# EAGLE design PMS alpha_v0.2 (EAGLE 9.0.1)

## Sheet 1 of 7
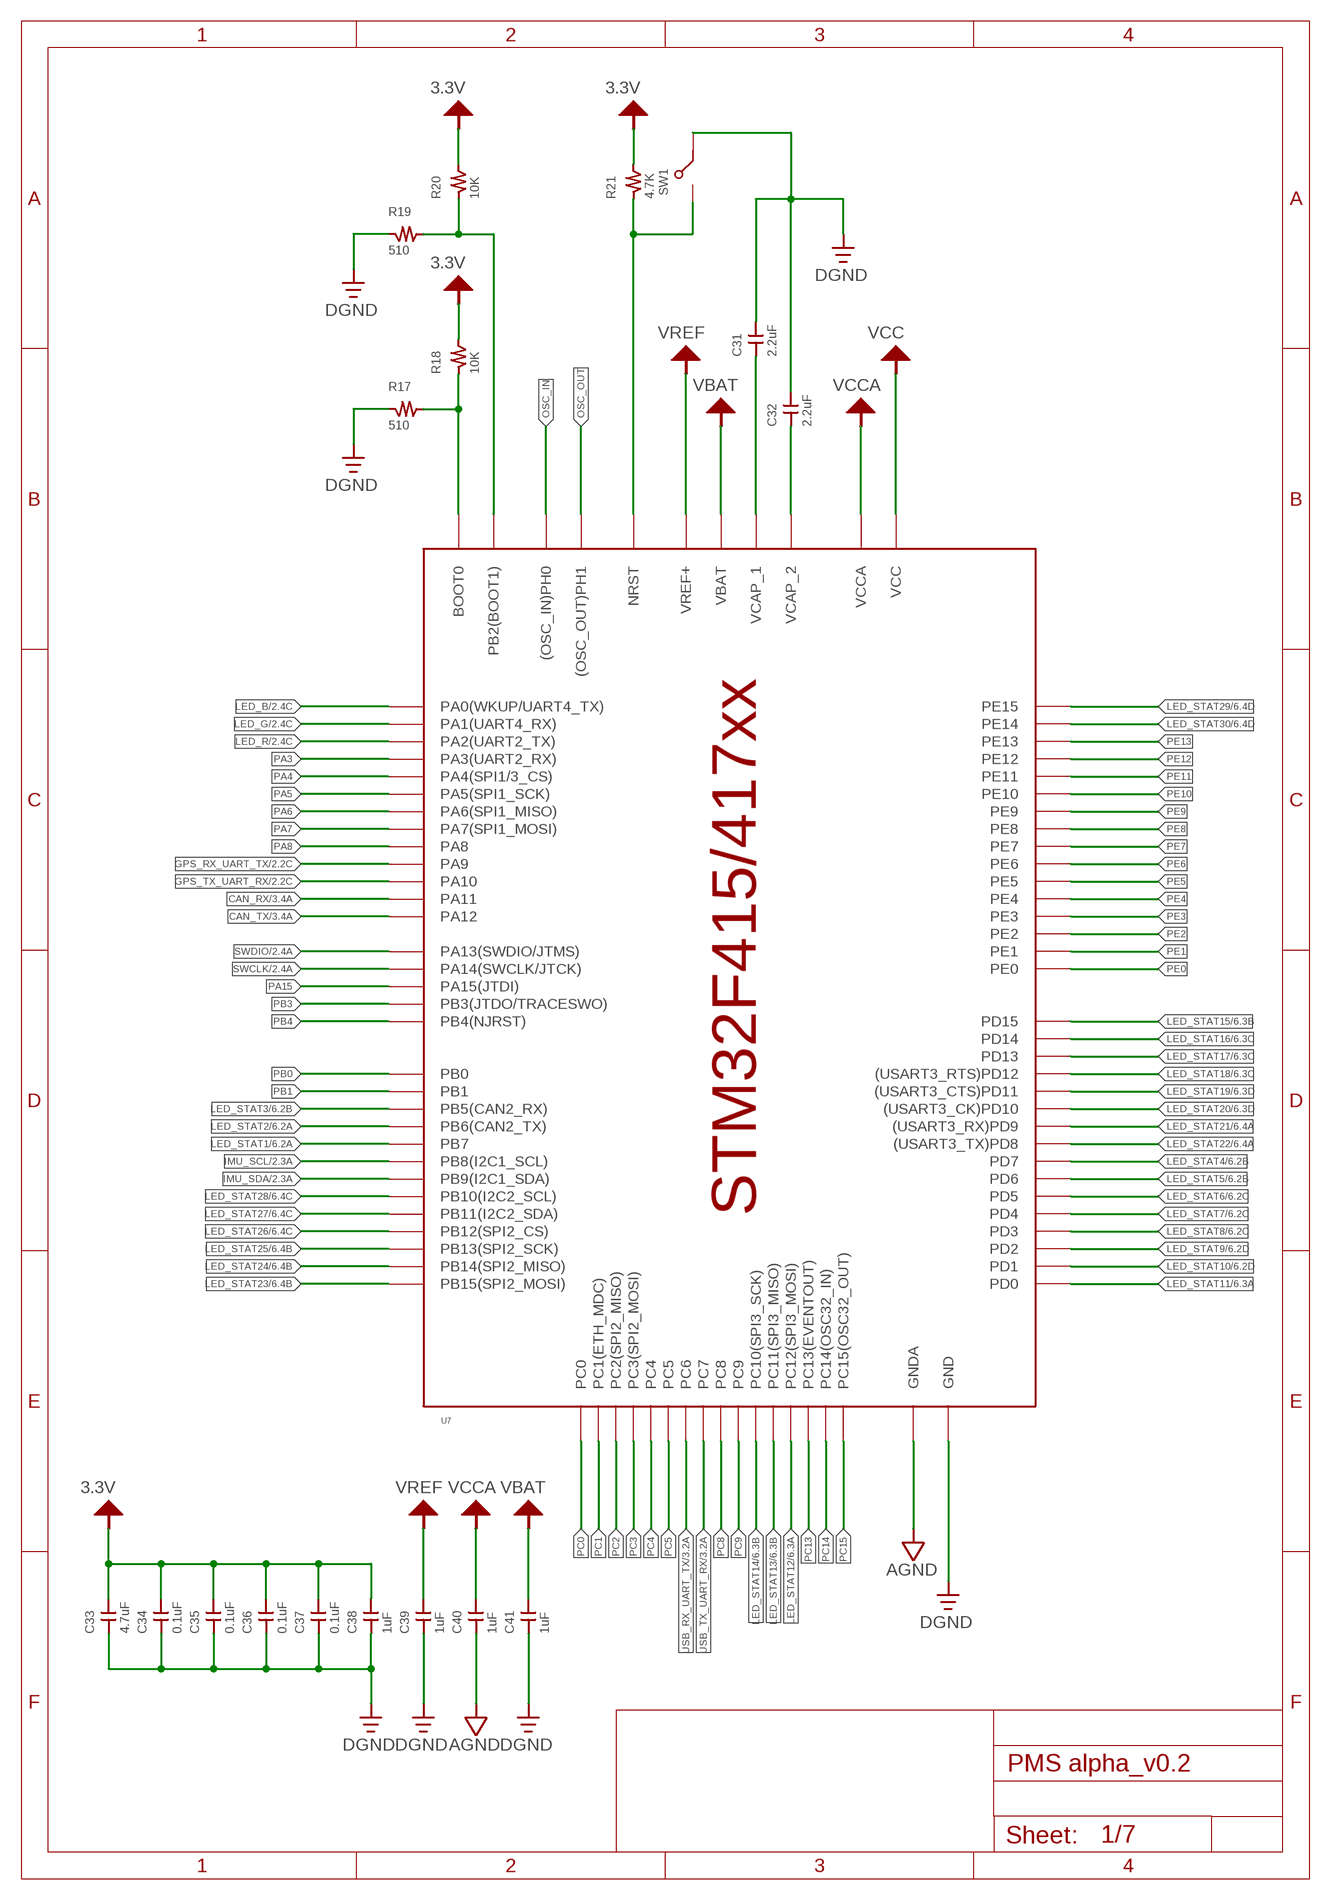
[diagram p0: schematic, sheet 1]

### Parts
C31  2.2uF  CAPACITOR_CHIP2012  [2012]
C32  2.2uF  CAPACITOR_CHIP2012  [2012]
C33  4.7uF  CAPACITOR_CHIP2012  [2012]
C34  0.1uF  CAPACITOR_CHIP2012  [2012]
C35  0.1uF  CAPACITOR_CHIP2012  [2012]
C36  0.1uF  CAPACITOR_CHIP2012  [2012]
C37  0.1uF  CAPACITOR_CHIP2012  [2012]
C38  1uF  CAPACITOR_CHIP2012  [2012]
C39  1uF  CAPACITOR_CHIP2012  [2012]
C40  1uF  CAPACITOR_CHIP2012  [2012]
C41  1uF  CAPACITOR_CHIP2012  [2012]
R17  510  RESISTOR_CHIP_2012  [2012]
R18  10K  RESISTOR_CHIP_2012  [2012]
R19  510  RESISTOR_CHIP_2012  [2012]
R20  10K  RESISTOR_CHIP_2012  [2012]
R21  4.7K  RESISTOR_CHIP_2012  [2012]
SW1  SPST(6.5PITCH)  [6.5PITCH]
U7  STM32F415/417  [LQFP100]

### Nets
!NRST: R21.P$1 SW1.P$1 U7.P$14(NRST)
BOOT4: R19.P$2 R20.P$1 U7.P$37(PB2(BOOT1))
BOOT5: R17.P$2 R18.P$1 U7.P$94(BOOT0)
CAN_RX: U7.P$70(PA11) ; also sheet 3
CAN_TX: U7.P$71(PA12) ; also sheet 3
DGND: C31.P$2 C32.P$2 C33.P$1 C34.P$1 C35.P$1 C36.P$1 C37.P$1 C38.P$1 C39.P$1 C40.P$1 C41.P$1 R17.P$1 R19.P$1 SW1.P$2 U7.P$10(GND) U7.P$20(GNDA) U7.P$27(GND) U7.P$74(GND) U7.P$99(GND) ; supply symbol labelled AGND ; also sheet 2,3,4,5
GPS_RX_UART_TX: U7.P$68(PA9) ; also sheet 2
GPS_TX_UART_RX: U7.P$69(PA10) ; also sheet 2
IMU_SCL: U7.P$95(PB8(I2C1_SCL)) ; also sheet 2
IMU_SDA: U7.P$96(PB9(I2C1_SDA)) ; also sheet 2
LED_B: U7.P$23(PA0(WKUP/UART4_TX)) ; also sheet 2
LED_G: U7.P$24(PA1(UART4_RX)) ; also sheet 2
LED_R: U7.P$25(PA2(UART2_TX)) ; also sheet 2
LED_STAT1: U7.P$93(PB7) ; also sheet 6
LED_STAT2: U7.P$92(PB6(CAN2_TX)) ; also sheet 6
LED_STAT3: U7.P$91(PB5(CAN2_RX)) ; also sheet 6
LED_STAT4: U7.P$88(PD7) ; also sheet 6
LED_STAT5: U7.P$87(PD6) ; also sheet 6
LED_STAT6: U7.P$86(PD5) ; also sheet 6
LED_STAT7: U7.P$85(PD4) ; also sheet 6
LED_STAT8: U7.P$84(PD3) ; also sheet 6
LED_STAT9: U7.P$83(PD2) ; also sheet 6
LED_STAT10: U7.P$82(PD1) ; also sheet 6
LED_STAT11: U7.P$81(PD0) ; also sheet 6
LED_STAT12: U7.P$80(PC12(SPI3_MOSI)) ; also sheet 6
LED_STAT13: U7.P$79(PC11(SPI3_MISO)) ; also sheet 6
LED_STAT14: U7.P$78(PC10(SPI3_SCK)) ; also sheet 6
LED_STAT15: U7.P$62(PD15) ; also sheet 6
LED_STAT16: U7.P$61(PD14) ; also sheet 6
LED_STAT17: U7.P$60(PD13) ; also sheet 6
LED_STAT18: U7.P$59((USART3_RTS)PD12) ; also sheet 6
LED_STAT19: U7.P$58((USART3_CTS)PD11) ; also sheet 6
LED_STAT20: U7.P$57((USART3_CK)PD10) ; also sheet 6
LED_STAT21: U7.P$56((USART3_RX)PD9) ; also sheet 6
LED_STAT22: U7.P$55((USART3_TX)PD8) ; also sheet 6
LED_STAT23: U7.P$54(PB15(SPI2_MOSI)) ; also sheet 6
LED_STAT24: U7.P$53(PB14(SPI2_MISO)) ; also sheet 6
LED_STAT25: U7.P$52(PB13(SPI2_SCK)) ; also sheet 6
LED_STAT26: U7.P$51(PB12(SPI2_CS)) ; also sheet 6
LED_STAT27: U7.P$48(PB11(I2C2_SDA)) ; also sheet 6
LED_STAT28: U7.P$47(PB10(I2C2_SCL)) ; also sheet 6
LED_STAT29: U7.P$46(PE15) ; also sheet 6
LED_STAT30: U7.P$45(PE14) ; also sheet 6
OSC_IN: U7.P$12((OSC_IN)PH0)
OSC_OUT: U7.P$13((OSC_OUT)PH1)
PA3: U7.P$26(PA3(UART2_RX))
PA4: U7.P$29(PA4(SPI1/3_CS))
PA5: U7.P$30(PA5(SPI1_SCK))
PA6: U7.P$31(PA6(SPI1_MISO))
PA7: U7.P$32(PA7(SPI1_MOSI))
PA8: U7.P$67(PA8)
PA15: U7.P$77(PA15(JTDI))
PB0: U7.P$35(PB0)
PB1: U7.P$36(PB1)
PB3: U7.P$89(PB3(JTDO/TRACESWO))
PB4: U7.P$90(PB4(NJRST))
PC0: U7.P$15(PC0)
PC1: U7.P$16(PC1(ETH_MDC))
PC2: U7.P$17(PC2(SPI2_MISO))
PC3: U7.P$18(PC3(SPI2_MOSI))
PC4: U7.P$33(PC4)
PC5: U7.P$34(PC5)
PC8: U7.P$65(PC8)
PC9: U7.P$66(PC9)
PC13: U7.P$7(PC13(EVENTOUT))
PC14: U7.P$8(PC14(OSC32_IN))
PC15: U7.P$9(PC15(OSC32_OUT))
PE0: U7.P$97(PE0)
PE1: U7.P$98(PE1)
PE2: U7.P$1(PE2)
PE3: U7.P$2(PE3)
PE4: U7.P$3(PE4)
PE5: U7.P$4(PE5)
PE6: U7.P$5(PE6)
PE7: U7.P$38(PE7)
PE8: U7.P$39(PE8)
PE9: U7.P$40(PE9)
PE10: U7.P$41(PE10)
PE11: U7.P$42(PE11)
PE12: U7.P$43(PE12)
PE13: U7.P$44(PE13)
SWCLK: U7.P$76(PA14(SWCLK/JTCK)) ; also sheet 2
SWDIO: U7.P$72(PA13(SWDIO/JTMS)) ; also sheet 2
USB_RX_UART_TX: U7.P$63(PC6) ; also sheet 3
USB_TX_UART_RX: U7.P$64(PC7) ; also sheet 3
VCAP5: C32.P$1 U7.P$73(VCAP_2)
VCAP6: C31.P$1 U7.P$49(VCAP_1)
VCC_3.3V: C33.P$2 C34.P$2 C35.P$2 C36.P$2 C37.P$2 C38.P$2 C39.P$2 C40.P$2 C41.P$2 R18.P$2 R20.P$2 R21.P$2 U7.P$6(VBAT) U7.P$11(VCC) U7.P$19(VCC) U7.P$21(VREF+) U7.P$22(VCCA) U7.P$28(VCC) U7.P$50(VCC) U7.P$75(VCC) U7.P$100(VCC) ; supply symbol labelled 3.3V, VCC, VCCA, VBAT, VREF ; also sheet 2,3,4,6

## Sheet 2 of 7
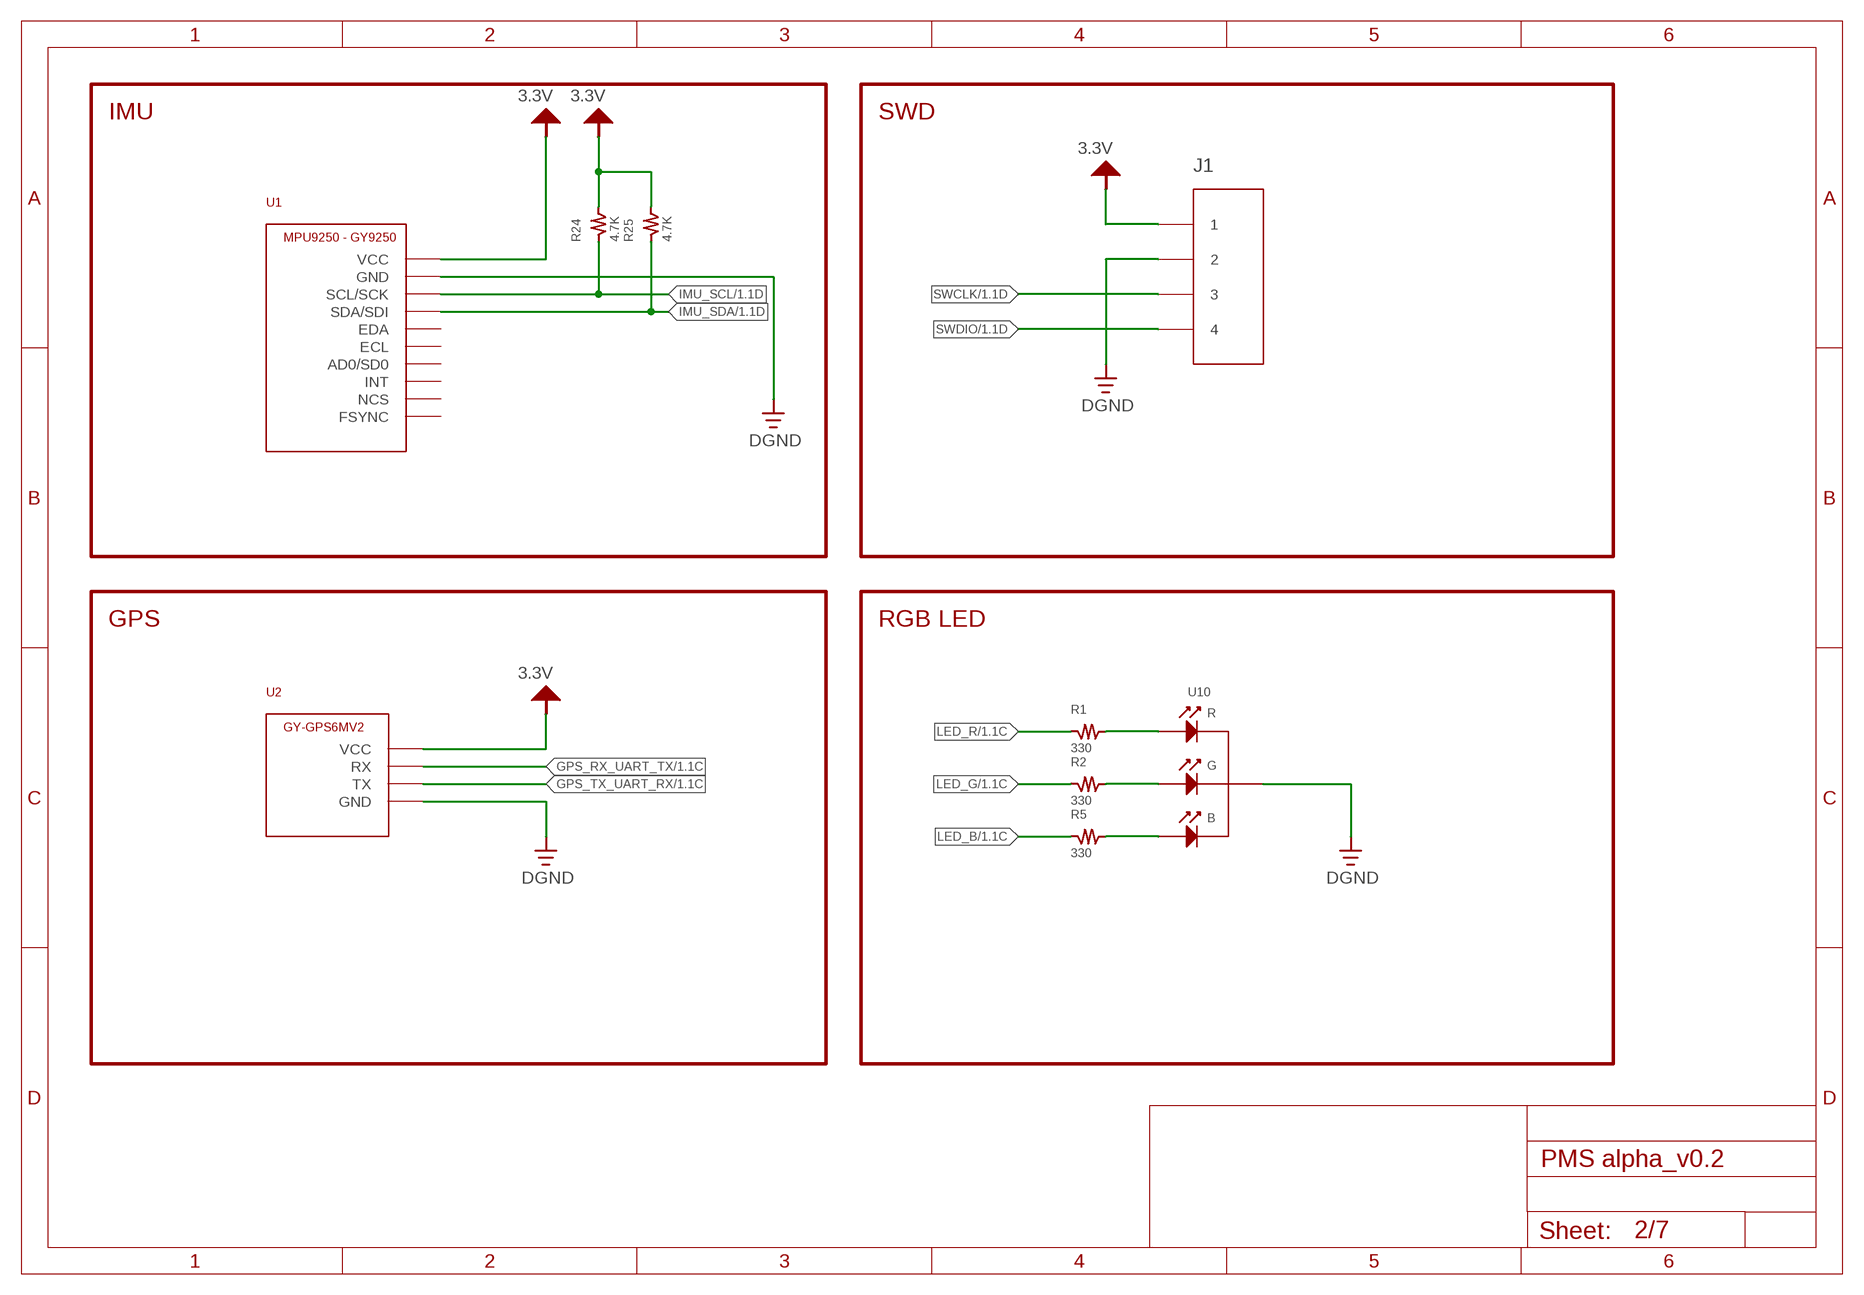
[diagram p1: schematic, sheet 2]

### Parts
J1  4PIN_2.54  [4PIN]
R1  330  RESISTOR_CHIP_2012  [2012]
R2  330  RESISTOR_CHIP_2012  [2012]
R5  330  RESISTOR_CHIP_2012  [2012]
R24  4.7K  RESISTOR_CHIP_2012  [2012]
R25  4.7K  RESISTOR_CHIP_2012  [2012]
U1  MPU-9250  [GY-9250]
U2  GPS6MV2  [PAD_2.5MM]
U10  RGB_COM_K  [RGB_4PIN_2.5MM]

### Nets
DGND: J1.P$2 U1.P$2(GND) U2.P$4(GND) U10.P$4(K) ; also sheet 1,3,4,5
GPS_RX_UART_TX: U2.P$2(RX) ; also sheet 1
GPS_TX_UART_RX: U2.P$3(TX) ; also sheet 1
IMU_SCL: R24.P$1 U1.P$3(SCL/SCK) ; also sheet 1
IMU_SDA: R25.P$1 U1.P$4(SDA/SDI) ; also sheet 1
LED_B: R5.P$1 ; also sheet 1
LED_G: R2.P$1 ; also sheet 1
LED_R: R1.P$1 ; also sheet 1
N$2: R1.P$2 U10.P$1(A)
N$3: R2.P$2 U10.P$2(A)
N$8: R5.P$2 U10.P$3(A)
SWCLK: J1.P$3 ; also sheet 1
SWDIO: J1.P$4 ; also sheet 1
VCC_3.3V: J1.P$1 R24.P$2 R25.P$2 U1.P$1(VCC) U2.P$1(VCC) ; supply symbol labelled 3.3V ; also sheet 1,3,4,6
Unconnected: U1.P$5(EDA) U1.P$6(ECL) U1.P$7(AD0/SD0) U1.P$8(INT) U1.P$9(NCS) U1.P$10(FSYNC)

### Notes on the sheet
- IMU | SWD
- GPS | RGB LED

## Sheet 3 of 7
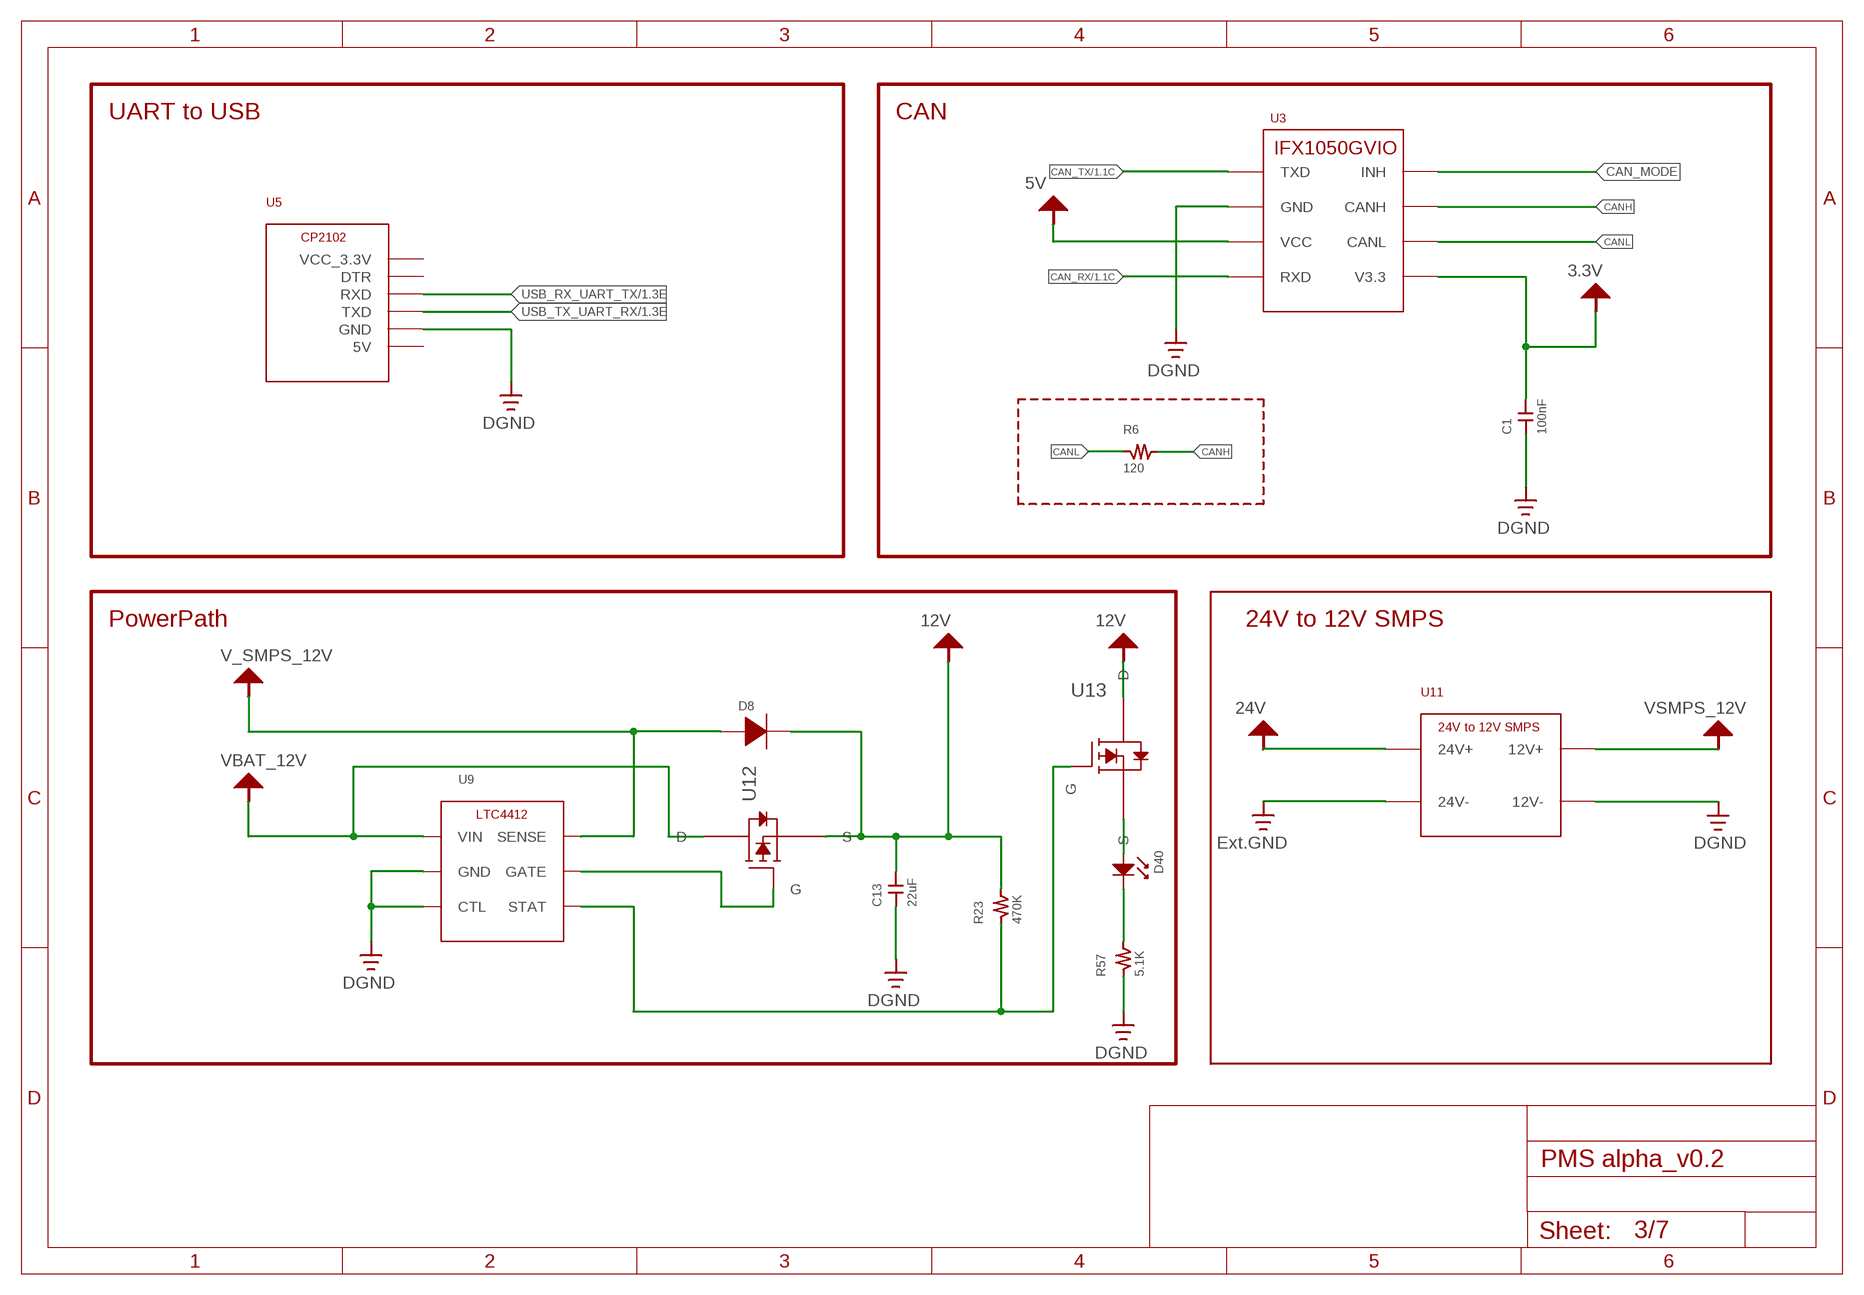
[diagram p2: schematic, sheet 3]

### Parts
C1  100nF  CAPACITOR_CHIP2012  [2012]
C13  22uF  CAPACITOR_CHIP2012  [2012]
D8  SBR10E45P5  [POWERDI5]
D40  LED_CHIP_2012  [2012]
R6  120  RESISTOR_CHIP_2012  [2012]
R23  470K  RESISTOR_CHIP_2012  [2012]
R57  5.1K  RESISTOR_CHIP_2012  [2012]
U3  IFX1050GVIO  [PG-DSO-8]
U5  CP2102-USB  [CP2102-6PIN]
U9  LTC4412ES6  [TSOT-23(3X3)]
U11  24V_TO_12V  [24V_12V_10A]
U12  SI4435FDY  [SO-8]
U13  STR2P3LLH6  [SOT-23-3]

### Nets
12V: C13.P$2 D8.K R23.P$2 U12.1(S) U12.2(S) U12.3(S) U13.3(D) ; also sheet 4
24V: U11.24V+ U11.24V+$1(24V+) ; also sheet 5
CAN_MODE: U3.P8(INH)
CAN_RX: U3.P4(RXD) ; also sheet 1
CAN_TX: U3.P1(TXD) ; also sheet 1
CANH: R6.P$2 U3.P7(CANH)
CANL: R6.P$1 U3.P6(CANL)
DGND: C1.P$1 C13.P$1 R57.P$1 U3.P2(GND) U5.P$5(GND) U9.P$2(GND) U9.P$3(CTL) U11.12V- ; also sheet 1,2,4,5
EXT.GND: U11.24V- U11.24V-$1(24V-) ; supply symbol labelled Ext.GND
N$27: U9.P$5(GATE) U12.4(G)
N$28: R23.P$1 U9.P$4(STAT) U13.1(G)
N$36: D40.K R57.P$2
N$60: D40.A U13.2(S)
USB_RX_UART_TX: U5.P$3(RXD) ; also sheet 1
USB_TX_UART_RX: U5.P$4(TXD) ; also sheet 1
V_SMPS_12V: D8.A$1(A) D8.A$2(A) U9.P$6(SENSE) U11.12V+ ; supply symbol labelled VSMPS_12V
VBAT_12V: U9.P$1(VIN) U12.5(D) U12.6(D) U12.7(D) U12.8(D) ; also sheet 5
VCC_3.3V: C1.P$2 U3.P5(V3.3) ; supply symbol labelled 3.3V ; also sheet 1,2,4,6
VCC_5V: U3.P3(VCC) ; supply symbol labelled 5V ; also sheet 4
Unconnected: U5.P$1(VCC_3.3V) U5.P$2(DTR) U5.P$6(5V)

### Notes on the sheet
- UART to USB | CAN
- PowerPath | 24V to 12V SMPS

## Sheet 4 of 7
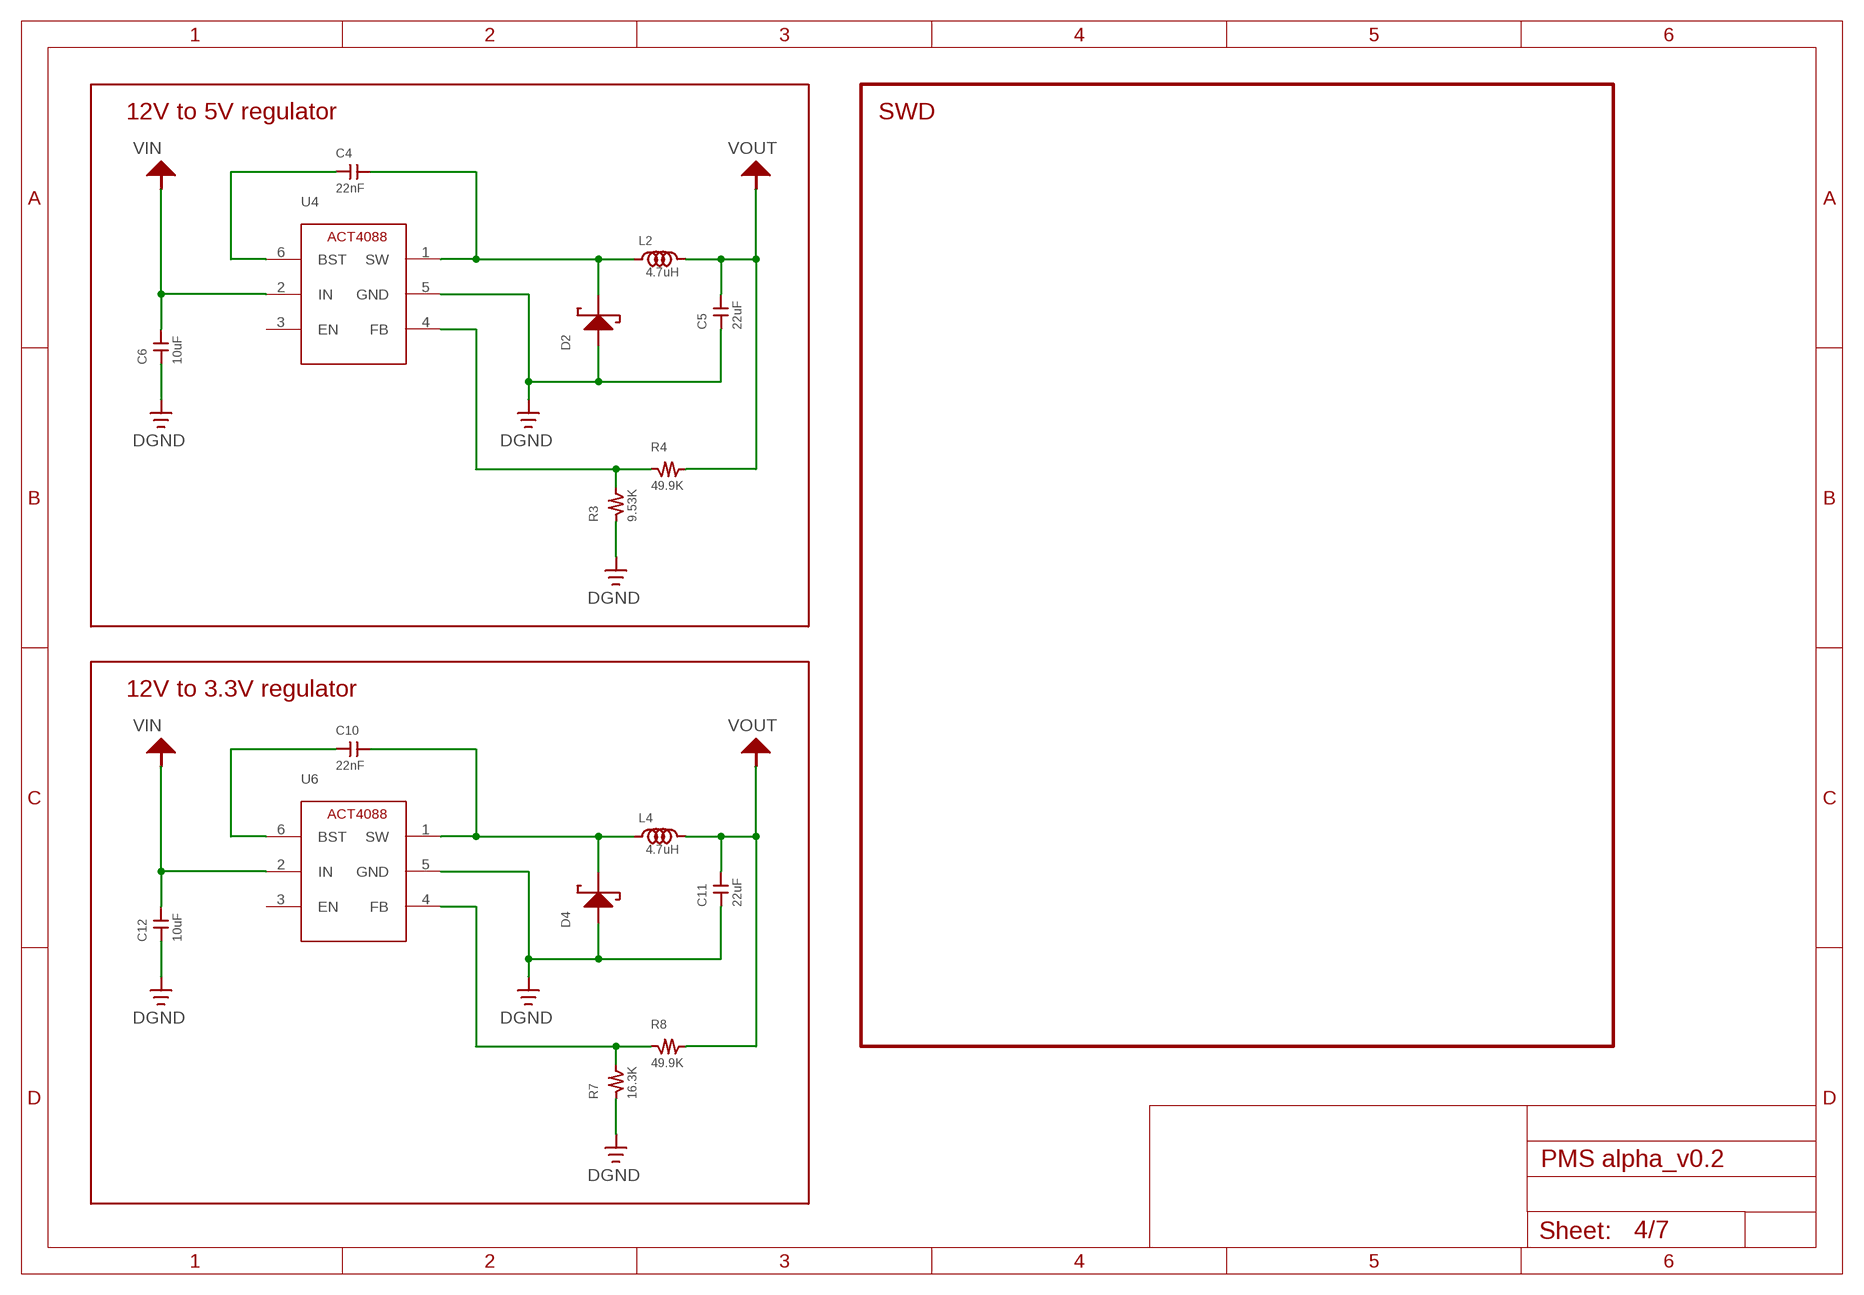
[diagram p3: schematic, sheet 4]

### Parts
C4  22nF  CAPACITOR_CHIP2012  [2012]
C5  22uF  CAPACITOR_CHIP2012  [2012]
C6  10uF  CAPACITOR_CHIP2012  [2012]
C10  22nF  CAPACITOR_CHIP2012  [2012]
C11  22uF  CAPACITOR_CHIP2012  [2012]
C12  10uF  CAPACITOR_CHIP2012  [2012]
D2  NSR20F30  [DSN2(1608)]
D4  NSR20F30  [DSN2(1608)]
L2  4.7uH  INDUCTOR2012  [2012]
L4  4.7uH  INDUCTOR2012  [2012]
R3  9.53K  RESISTOR_CHIP_2012  [2012]
R4  49.9K  RESISTOR_CHIP_2012  [2012]
R7  16.3K  RESISTOR_CHIP_2012  [2012]
R8  49.9K  RESISTOR_CHIP_2012  [2012]
U4  ACT4088US-T  [SOT-23-6]
U6  ACT4088US-T  [SOT-23-6]

### Nets
12V: C6.P$2 C12.P$2 U4.2(IN) U6.2(IN) ; supply symbol labelled VIN ; also sheet 3
DGND: C5.P$1 C6.P$1 C11.P$1 C12.P$1 D2.A D4.A R3.P$1 R7.P$1 U4.5(GND) U6.5(GND) ; also sheet 1,2,3,5
N$4: C4.P$1 U4.6(BST)
N$7: C4.P$2 D2.K L2.P$1 U4.1(SW)
N$9: R3.P$2 R4.P$1 U4.4(FB)
N$13: C10.P$1 U6.6(BST)
N$14: C10.P$2 D4.K L4.P$1 U6.1(SW)
N$15: R7.P$2 R8.P$1 U6.4(FB)
VCC_3.3V: C11.P$2 L4.P$2 R8.P$2 ; supply symbol labelled VOUT ; also sheet 1,2,3,6
VCC_5V: C5.P$2 L2.P$2 R4.P$2 ; supply symbol labelled VOUT ; also sheet 3
Unconnected: U4.3(EN) U6.3(EN)

### Notes on the sheet
- SWD
- 12V to 5V regulator
- 12V to 3.3V regulator

## Sheet 5 of 7
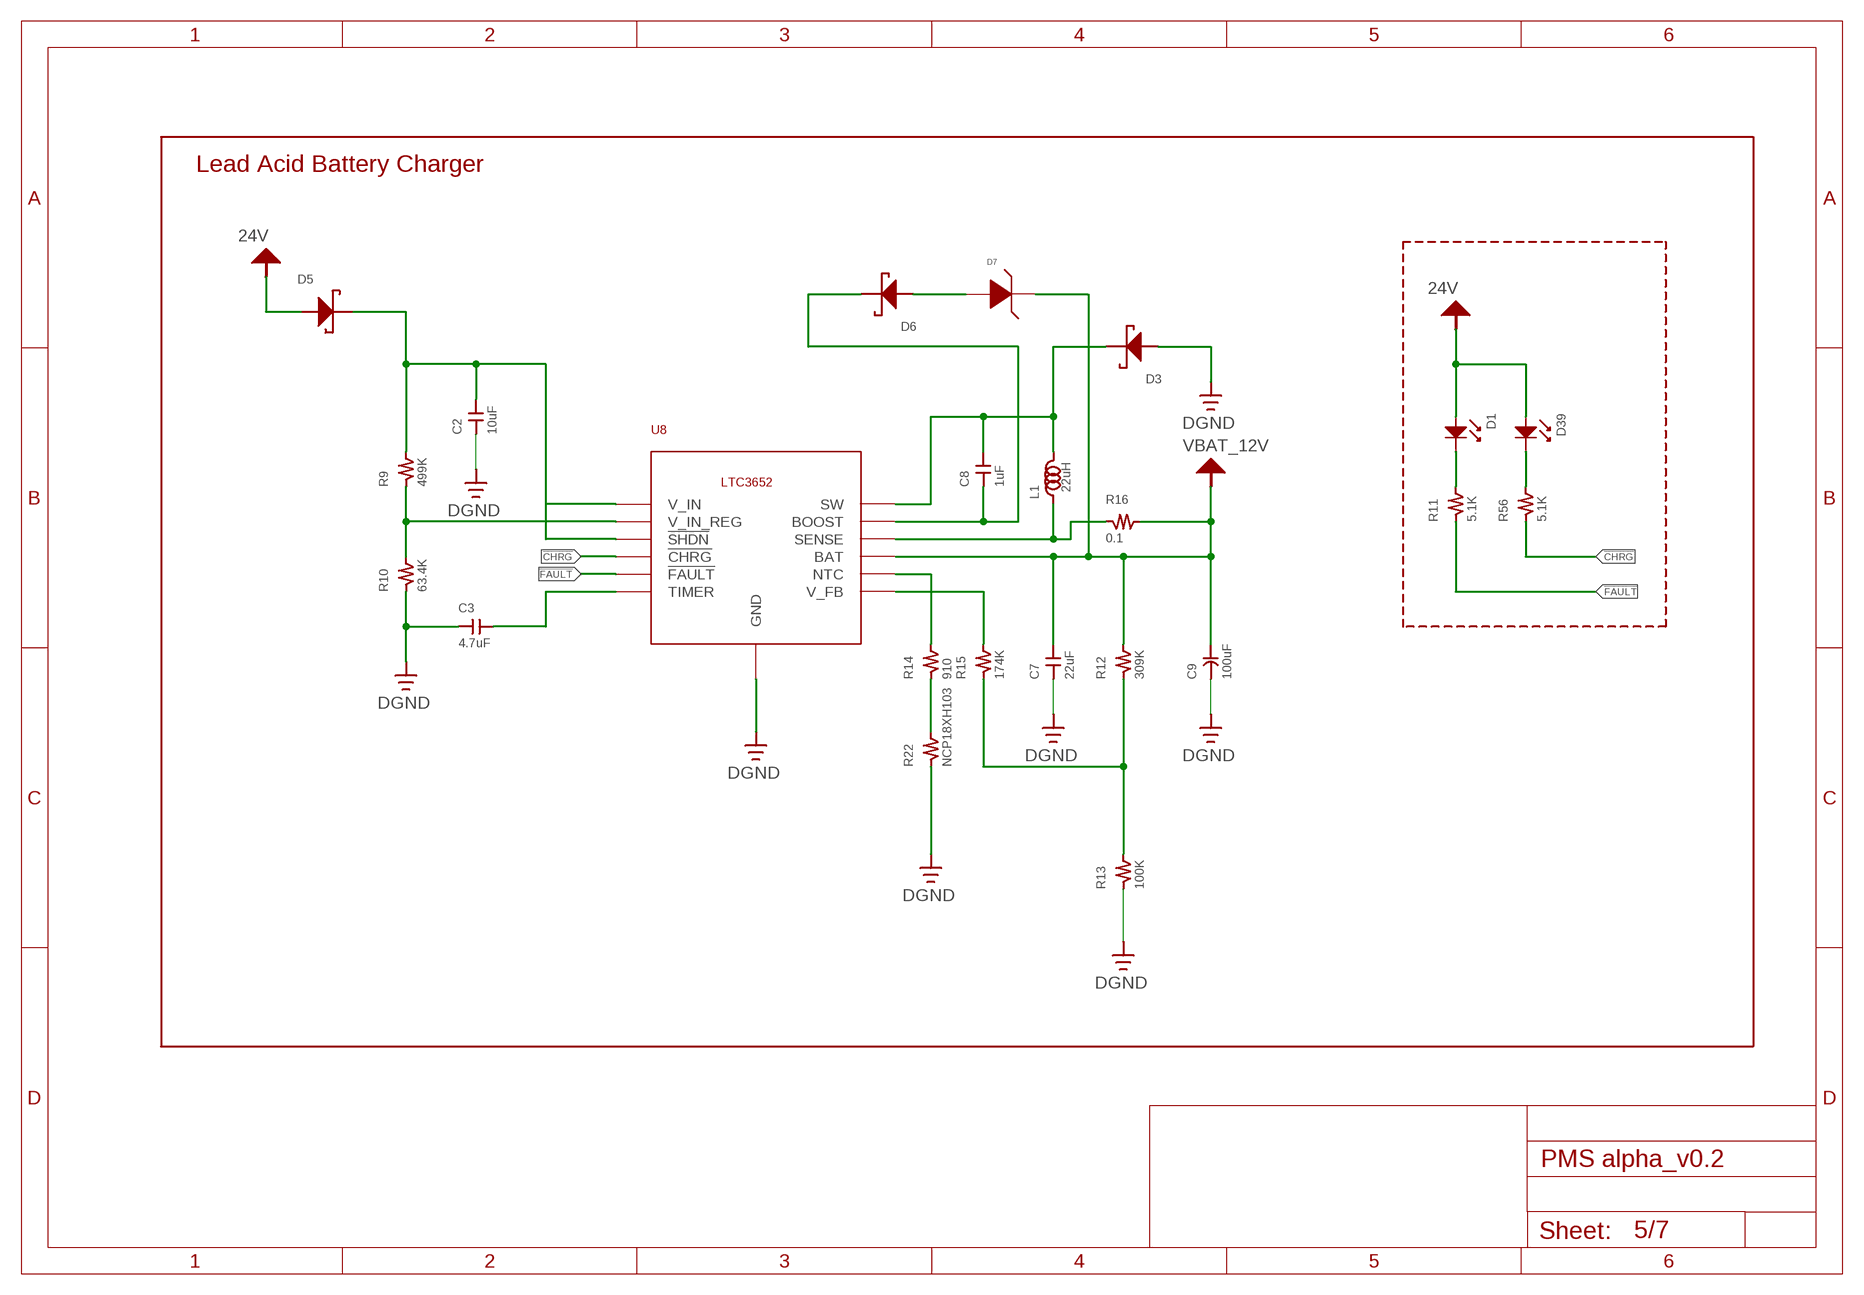
[diagram p4: schematic, sheet 5]

### Parts
C2  10uF  CAPACITOR_CHIP2012  [2012]
C3  4.7uF  CAPACITOR_CHIP2012  [2012]
C7  22uF  CAPACITOR_CHIP2012  [2012]
C8  1uF  CAPACITOR_CHIP2012  [2012]
C9  100uF  CAPACITOR_POLAR_F55_SIZE  [F55_SIZE(SMD)]
D1  LED_CHIP_2012  [2012]
D3  NSR20F30  [DSN2(1608)]
D5  NSR20F30  [DSN2(1608)]
D6  NSR20F30  [DSN2(1608)]
D7  BZX84C6V2L  [SOT-23]
D39  LED_CHIP_2012  [2012]
L1  22uH  INDUCTOR4040  [4040SIZE]
R9  499K  RESISTOR_CHIP_2012  [2012]
R10  63.4K  RESISTOR_CHIP_2012  [2012]
R11  5.1K  RESISTOR_CHIP_2012  [2012]
R12  309K  RESISTOR_CHIP_2012  [2012]
R13  100K  RESISTOR_CHIP_2012  [2012]
R14  910  RESISTOR_CHIP_2012  [2012]
R15  174K  RESISTOR_CHIP_2012  [2012]
R16  0.1  RESISTOR_CHIP_6332  [6432]
R22  NCP18XH103  RESISTOR_CHIP_1608  [1608]
R56  5.1K  RESISTOR_CHIP_2012  [2012]
U8  LTC3652HVIMSE  [MSOP-12]

### Nets
24V: D1.A D5.A D39.A ; also sheet 3
!CHRG!: R56.P$1 U8.P$4(!CHRG!)
!FAULT!: R11.P$1 U8.P$5(!FAULT!)
DGND: C2.P$1 C3.P$1 C7.P$1 C9.GND D3.A R10.P$1 R13.P$1 R22.P$1 U8.P$13(GND) ; also sheet 1,2,3,4
N$10: R9.P$1 R10.P$2 U8.P$2(V_IN_REG)
N$11: C2.P$2 D5.K R9.P$2 U8.P$1(V_IN) U8.P$3(!SHDN!)
N$12: D1.K R11.P$2
N$16: C3.P$2 U8.P$6(TIMER)
N$17: D39.K R56.P$2
N$18: R12.P$1 R13.P$2 R15.P$1
N$19: R14.P$2 U8.P$8(NTC)
N$20: R15.P$2 U8.P$7(V_FB)
N$21: C8.P$2 D3.K L1.P$2 U8.P$12(SW)
N$22: C8.P$1 D6.K U8.P$11(BOOST)
N$23: L1.P$1 R16.P$1 U8.P$10(SENSE)
N$24: R14.P$1 R22.P$2
N$25: D6.A D7.P$1(A)
VBAT_12V: C7.P$2 C9.VCC D7.P$3(K) R12.P$2 R16.P$2 U8.P$9(BAT) ; also sheet 3

### Notes on the sheet
- Lead Acid Battery Charger

## Sheet 6 of 7
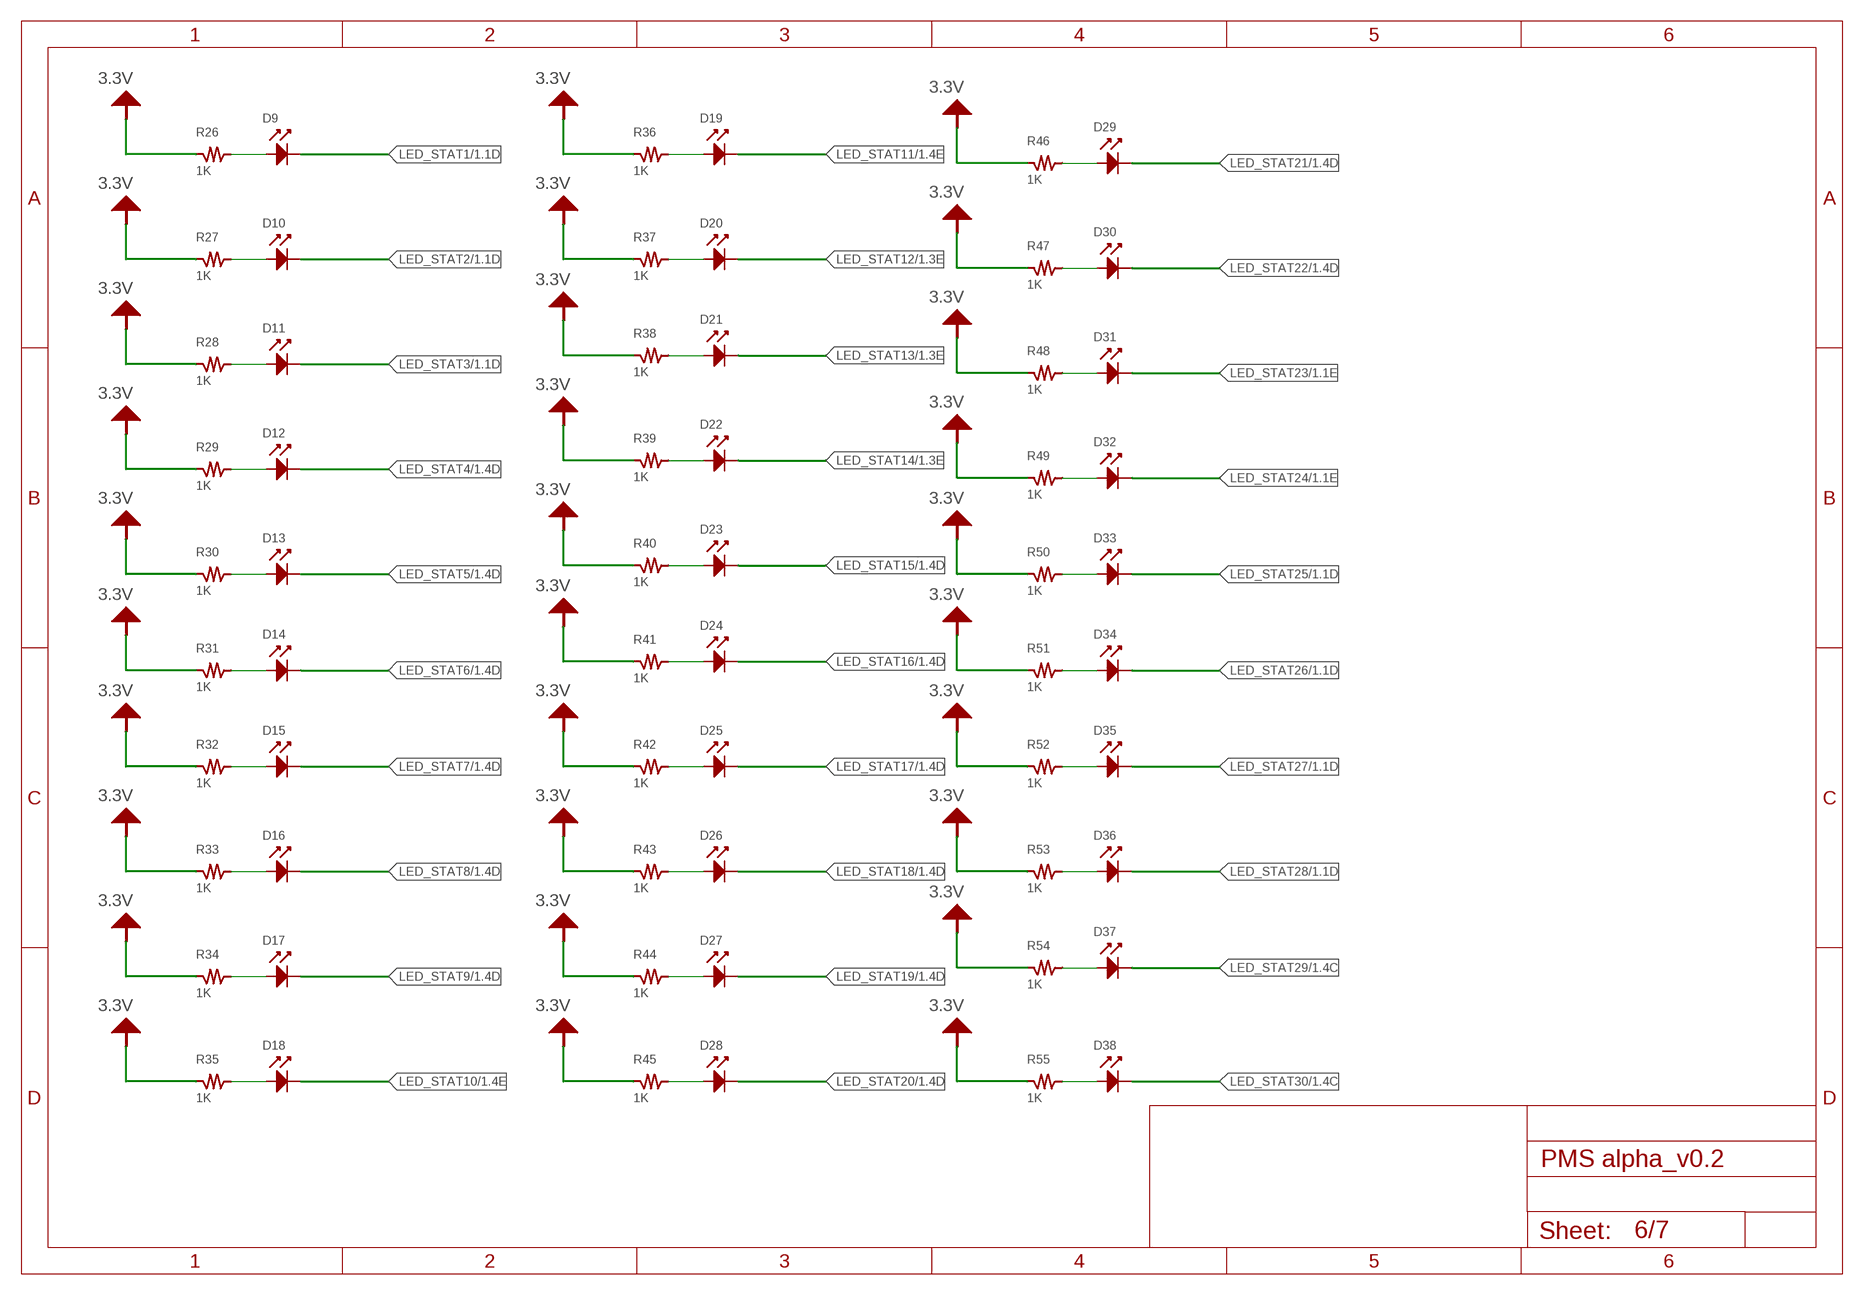
[diagram p5: schematic, sheet 6]

### Parts
D9  LED_5MM_DIP  [DIP_5MM]
D10  LED_5MM_DIP  [DIP_5MM]
D11  LED_5MM_DIP  [DIP_5MM]
D12  LED_5MM_DIP  [DIP_5MM]
D13  LED_5MM_DIP  [DIP_5MM]
D14  LED_5MM_DIP  [DIP_5MM]
D15  LED_5MM_DIP  [DIP_5MM]
D16  LED_5MM_DIP  [DIP_5MM]
D17  LED_5MM_DIP  [DIP_5MM]
D18  LED_5MM_DIP  [DIP_5MM]
D19  LED_5MM_DIP  [DIP_5MM]
D20  LED_5MM_DIP  [DIP_5MM]
D21  LED_5MM_DIP  [DIP_5MM]
D22  LED_5MM_DIP  [DIP_5MM]
D23  LED_5MM_DIP  [DIP_5MM]
D24  LED_5MM_DIP  [DIP_5MM]
D25  LED_5MM_DIP  [DIP_5MM]
D26  LED_5MM_DIP  [DIP_5MM]
D27  LED_5MM_DIP  [DIP_5MM]
D28  LED_5MM_DIP  [DIP_5MM]
D29  LED_5MM_DIP  [DIP_5MM]
D30  LED_5MM_DIP  [DIP_5MM]
D31  LED_5MM_DIP  [DIP_5MM]
D32  LED_5MM_DIP  [DIP_5MM]
D33  LED_5MM_DIP  [DIP_5MM]
D34  LED_5MM_DIP  [DIP_5MM]
D35  LED_5MM_DIP  [DIP_5MM]
D36  LED_5MM_DIP  [DIP_5MM]
D37  LED_5MM_DIP  [DIP_5MM]
D38  LED_5MM_DIP  [DIP_5MM]
R26  1K  RESISTOR_CHIP_2012  [2012]
R27  1K  RESISTOR_CHIP_2012  [2012]
R28  1K  RESISTOR_CHIP_2012  [2012]
R29  1K  RESISTOR_CHIP_2012  [2012]
R30  1K  RESISTOR_CHIP_2012  [2012]
R31  1K  RESISTOR_CHIP_2012  [2012]
R32  1K  RESISTOR_CHIP_2012  [2012]
R33  1K  RESISTOR_CHIP_2012  [2012]
R34  1K  RESISTOR_CHIP_2012  [2012]
R35  1K  RESISTOR_CHIP_2012  [2012]
R36  1K  RESISTOR_CHIP_2012  [2012]
R37  1K  RESISTOR_CHIP_2012  [2012]
R38  1K  RESISTOR_CHIP_2012  [2012]
R39  1K  RESISTOR_CHIP_2012  [2012]
R40  1K  RESISTOR_CHIP_2012  [2012]
R41  1K  RESISTOR_CHIP_2012  [2012]
R42  1K  RESISTOR_CHIP_2012  [2012]
R43  1K  RESISTOR_CHIP_2012  [2012]
R44  1K  RESISTOR_CHIP_2012  [2012]
R45  1K  RESISTOR_CHIP_2012  [2012]
R46  1K  RESISTOR_CHIP_2012  [2012]
R47  1K  RESISTOR_CHIP_2012  [2012]
R48  1K  RESISTOR_CHIP_2012  [2012]
R49  1K  RESISTOR_CHIP_2012  [2012]
R50  1K  RESISTOR_CHIP_2012  [2012]
R51  1K  RESISTOR_CHIP_2012  [2012]
R52  1K  RESISTOR_CHIP_2012  [2012]
R53  1K  RESISTOR_CHIP_2012  [2012]
R54  1K  RESISTOR_CHIP_2012  [2012]
R55  1K  RESISTOR_CHIP_2012  [2012]

### Nets
LED_STAT1: D9.K ; also sheet 1
LED_STAT2: D10.K ; also sheet 1
LED_STAT3: D11.K ; also sheet 1
LED_STAT4: D12.K ; also sheet 1
LED_STAT5: D13.K ; also sheet 1
LED_STAT6: D14.K ; also sheet 1
LED_STAT7: D15.K ; also sheet 1
LED_STAT8: D16.K ; also sheet 1
LED_STAT9: D17.K ; also sheet 1
LED_STAT10: D18.K ; also sheet 1
LED_STAT11: D19.K ; also sheet 1
LED_STAT12: D20.K ; also sheet 1
LED_STAT13: D21.K ; also sheet 1
LED_STAT14: D22.K ; also sheet 1
LED_STAT15: D23.K ; also sheet 1
LED_STAT16: D24.K ; also sheet 1
LED_STAT17: D25.K ; also sheet 1
LED_STAT18: D26.K ; also sheet 1
LED_STAT19: D27.K ; also sheet 1
LED_STAT20: D28.K ; also sheet 1
LED_STAT21: D29.K ; also sheet 1
LED_STAT22: D30.K ; also sheet 1
LED_STAT23: D31.K ; also sheet 1
LED_STAT24: D32.K ; also sheet 1
LED_STAT25: D33.K ; also sheet 1
LED_STAT26: D34.K ; also sheet 1
LED_STAT27: D35.K ; also sheet 1
LED_STAT28: D36.K ; also sheet 1
LED_STAT29: D37.K ; also sheet 1
LED_STAT30: D38.K ; also sheet 1
N$1: D9.A R26.P$2
N$5: D10.A R27.P$2
N$6: D15.A R32.P$2
N$32: D11.A R28.P$2
N$33: D12.A R29.P$2
N$34: D13.A R30.P$2
N$35: D14.A R31.P$2
N$37: D16.A R33.P$2
N$38: D17.A R34.P$2
N$39: D18.A R35.P$2
N$40: D19.A R36.P$2
N$41: D20.A R37.P$2
N$42: D21.A R38.P$2
N$43: D22.A R39.P$2
N$44: D23.A R40.P$2
N$45: D24.A R41.P$2
N$46: D25.A R42.P$2
N$47: D26.A R43.P$2
N$48: D27.A R44.P$2
N$49: D28.A R45.P$2
N$50: D29.A R46.P$2
N$51: D30.A R47.P$2
N$52: D31.A R48.P$2
N$53: D32.A R49.P$2
N$54: D33.A R50.P$2
N$55: D34.A R51.P$2
N$56: D35.A R52.P$2
N$57: D36.A R53.P$2
N$58: D37.A R54.P$2
N$59: D38.A R55.P$2
VCC_3.3V: R26.P$1 R27.P$1 R28.P$1 R29.P$1 R30.P$1 R31.P$1 R32.P$1 R33.P$1 R34.P$1 R35.P$1 R36.P$1 R37.P$1 R38.P$1 R39.P$1 R40.P$1 R41.P$1 R42.P$1 R43.P$1 R44.P$1 R45.P$1 R46.P$1 R47.P$1 R48.P$1 R49.P$1 R50.P$1 R51.P$1 R52.P$1 R53.P$1 R54.P$1 R55.P$1 ; supply symbol labelled 3.3V ; also sheet 1,2,3,4

## Sheet 7 of 7
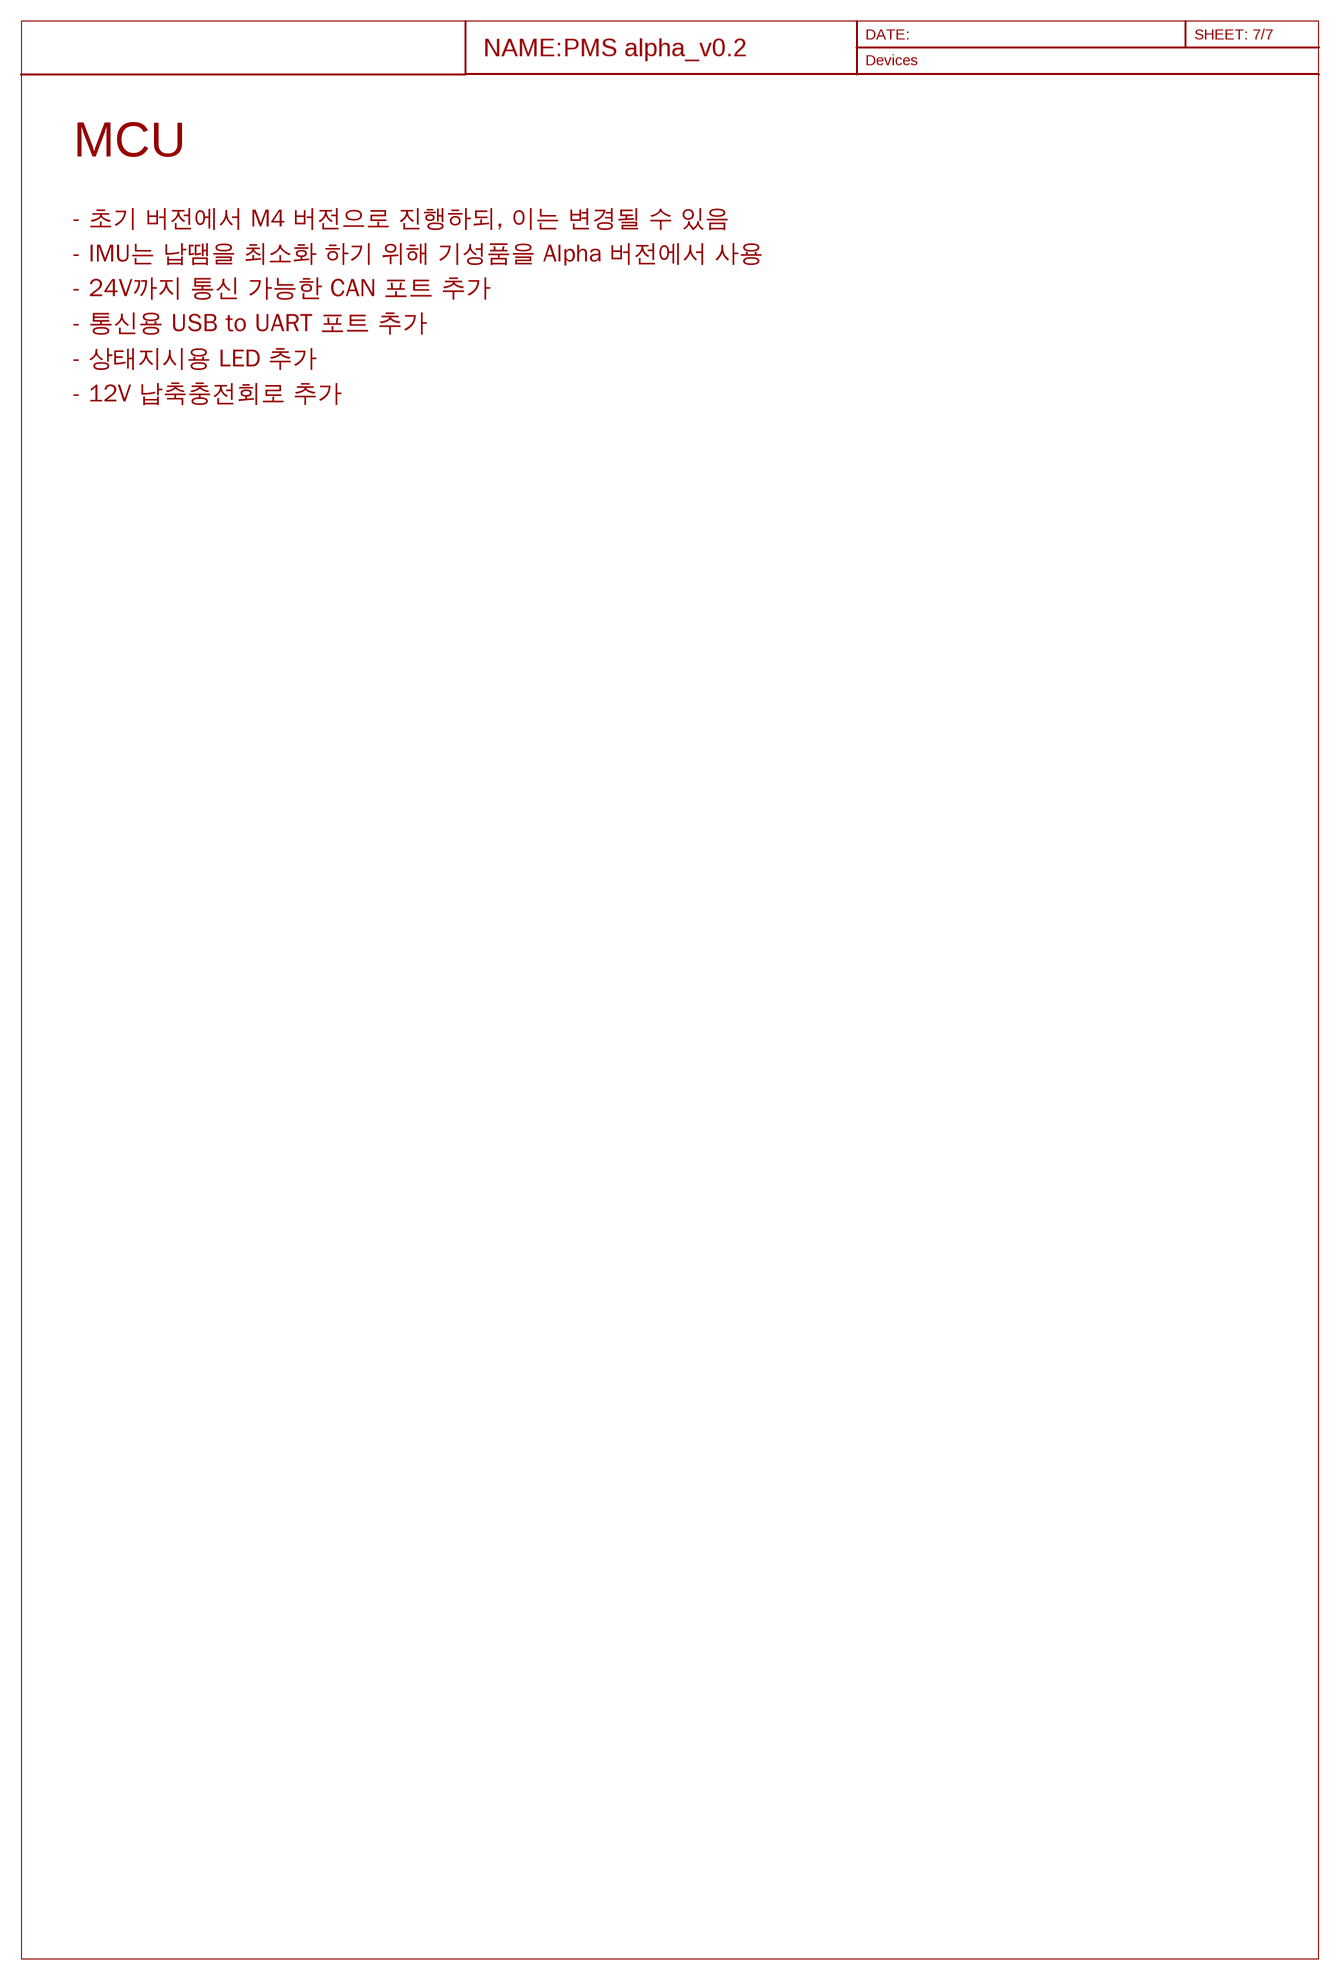
[diagram p6: schematic, sheet 7]

### Notes on the sheet
- MCU
- - 초기 버전에서 M4 버전으로 진행하되, 이는 변경될 수 있음
- - IMU는 납땜을 최소화 하기 위해 기성품을 Alpha 버전에서 사용
- - 24V까지 통신 가능한 CAN 포트 추가
- - 통신용 USB to UART 포트 추가
- - 상태지시용 LED 추가
- - 12V 납축충전회로 추가

## Library data of the parts
C1-C8 C10-C13 C31-C41 = passive:CAPACITOR_CHIP
C9 = passive:CAPACITOR_POLAR_
D1 D9-D40 = LED:LED
D2-D6 = Diode:NSR20F30
D7 = Diode:BZX84C6V2L
D8 = Diode:SBR10E45P5
J1 = connector:4PIN: 2.54mm pitch 4x1 pin Connector (Available as Headers or Pins)
L1 L2 L4 = passive:INDUCTOR
R1-R57 = passive:RESISTOR_CHIP_
SW1 = Switch:SPST: Tactile Switch
U1 = MPU-9250:MPU-9250
U2 = GPS:GPS6MV2
U3 = CAN:IFX1050GVIO: The HS CAN-transceiver IFX1050GVIO is optimized for high speed differential mode data transmission in industrial applications and is compatible to ISO/DIS 11898. It works as an interface between the CAN protocol controller and the physical differential bus in both, 12 V and 24 V systems. The IFX1050GVIO is designed to withstand the conditions of industrial applications and provides excellent EMC performance.
U4 U6 = Regulator:ACT4088: The ACT4088 is a current-mode step-down DC/DC converter that supplies up to 1.5A into 5V from a 12V input. 1.4MHz switching frequency allows the use of tiny external components, and internal loop compensation provides simple, stable power supplies with a minimum of external components. Optimized for use with ceramic input and output capacitors, the ACT4088 provides a very compact 1.5A power supply for space constrained mobile and consumer applications. The ACT4088 operates over a wide input voltage range and utilizes current-mode operation to provide excellent line and load transient response while requiring no external compensation components. Fault protection includes cycle-by-cycle current limiting, frequency fold-back, hiccup mode, and thermal shutdown. Internal soft-start provides a controlled startup with no overshoot, even at light loads. The ACT4088 is available in a tiny SOT23-6 package and requires very few external components.
U5 = USB_to_UART:CP2102-USB
U7 = ST-MCU:STM32F415/417
U8 = BatteryChargeIC:LTC3652
U9 = PowerPath:LTC4412: LTC4412 (Low Loss PowerPath Controller in ThinSOT) The LTC4412 controls an external P-channel MOSFET to create a near ideal diode function for power switchover or load sharing. This permits highly efficient OR’ing of multiple power sources for extended battery life and low selfheating. When conducting, the voltage drop across the MOSFET is typically 20mV. For applications with a wall adapter or other auxiliary power source, the load is automatically disconnected from the battery when the auxiliary source is connected. Two or more LTC4412s may be interconnected to allow load sharing between multiple batteries or charging of multiple batteries from a single charger. The wide supply operating range supports operation from one to six Li-Ion cells in series. The low quiescent current (11μA typical) is independent of the load current. The gate driver includes an internal voltage clamp for MOSFET protection. The STAT pin can be used to enable an auxiliary P-channel MOSFET power switch when an auxiliary supply is detected. This pin may also be used to indicate to a microcontroller that an auxiliary supply is connected. The control (CTL) input enables the user to force the primary MOSFET off and the STAT pin low. The LTC4412 is available in a low profile (1mm) ThinSOT package.
U10 = LED:RGB_COM_K
U11 = SMPS:24V_TO_12V
U12 = MOSFET:SI4435FDY
U13 = MOSFET:STR2P3LLH6: This device is a P-channel Power MOSFET developed using the STripFET™ H6 technology with a new trench gate structure. The resulting Power MOSFET exhibits very low RDS(on) in all packages.

## Board
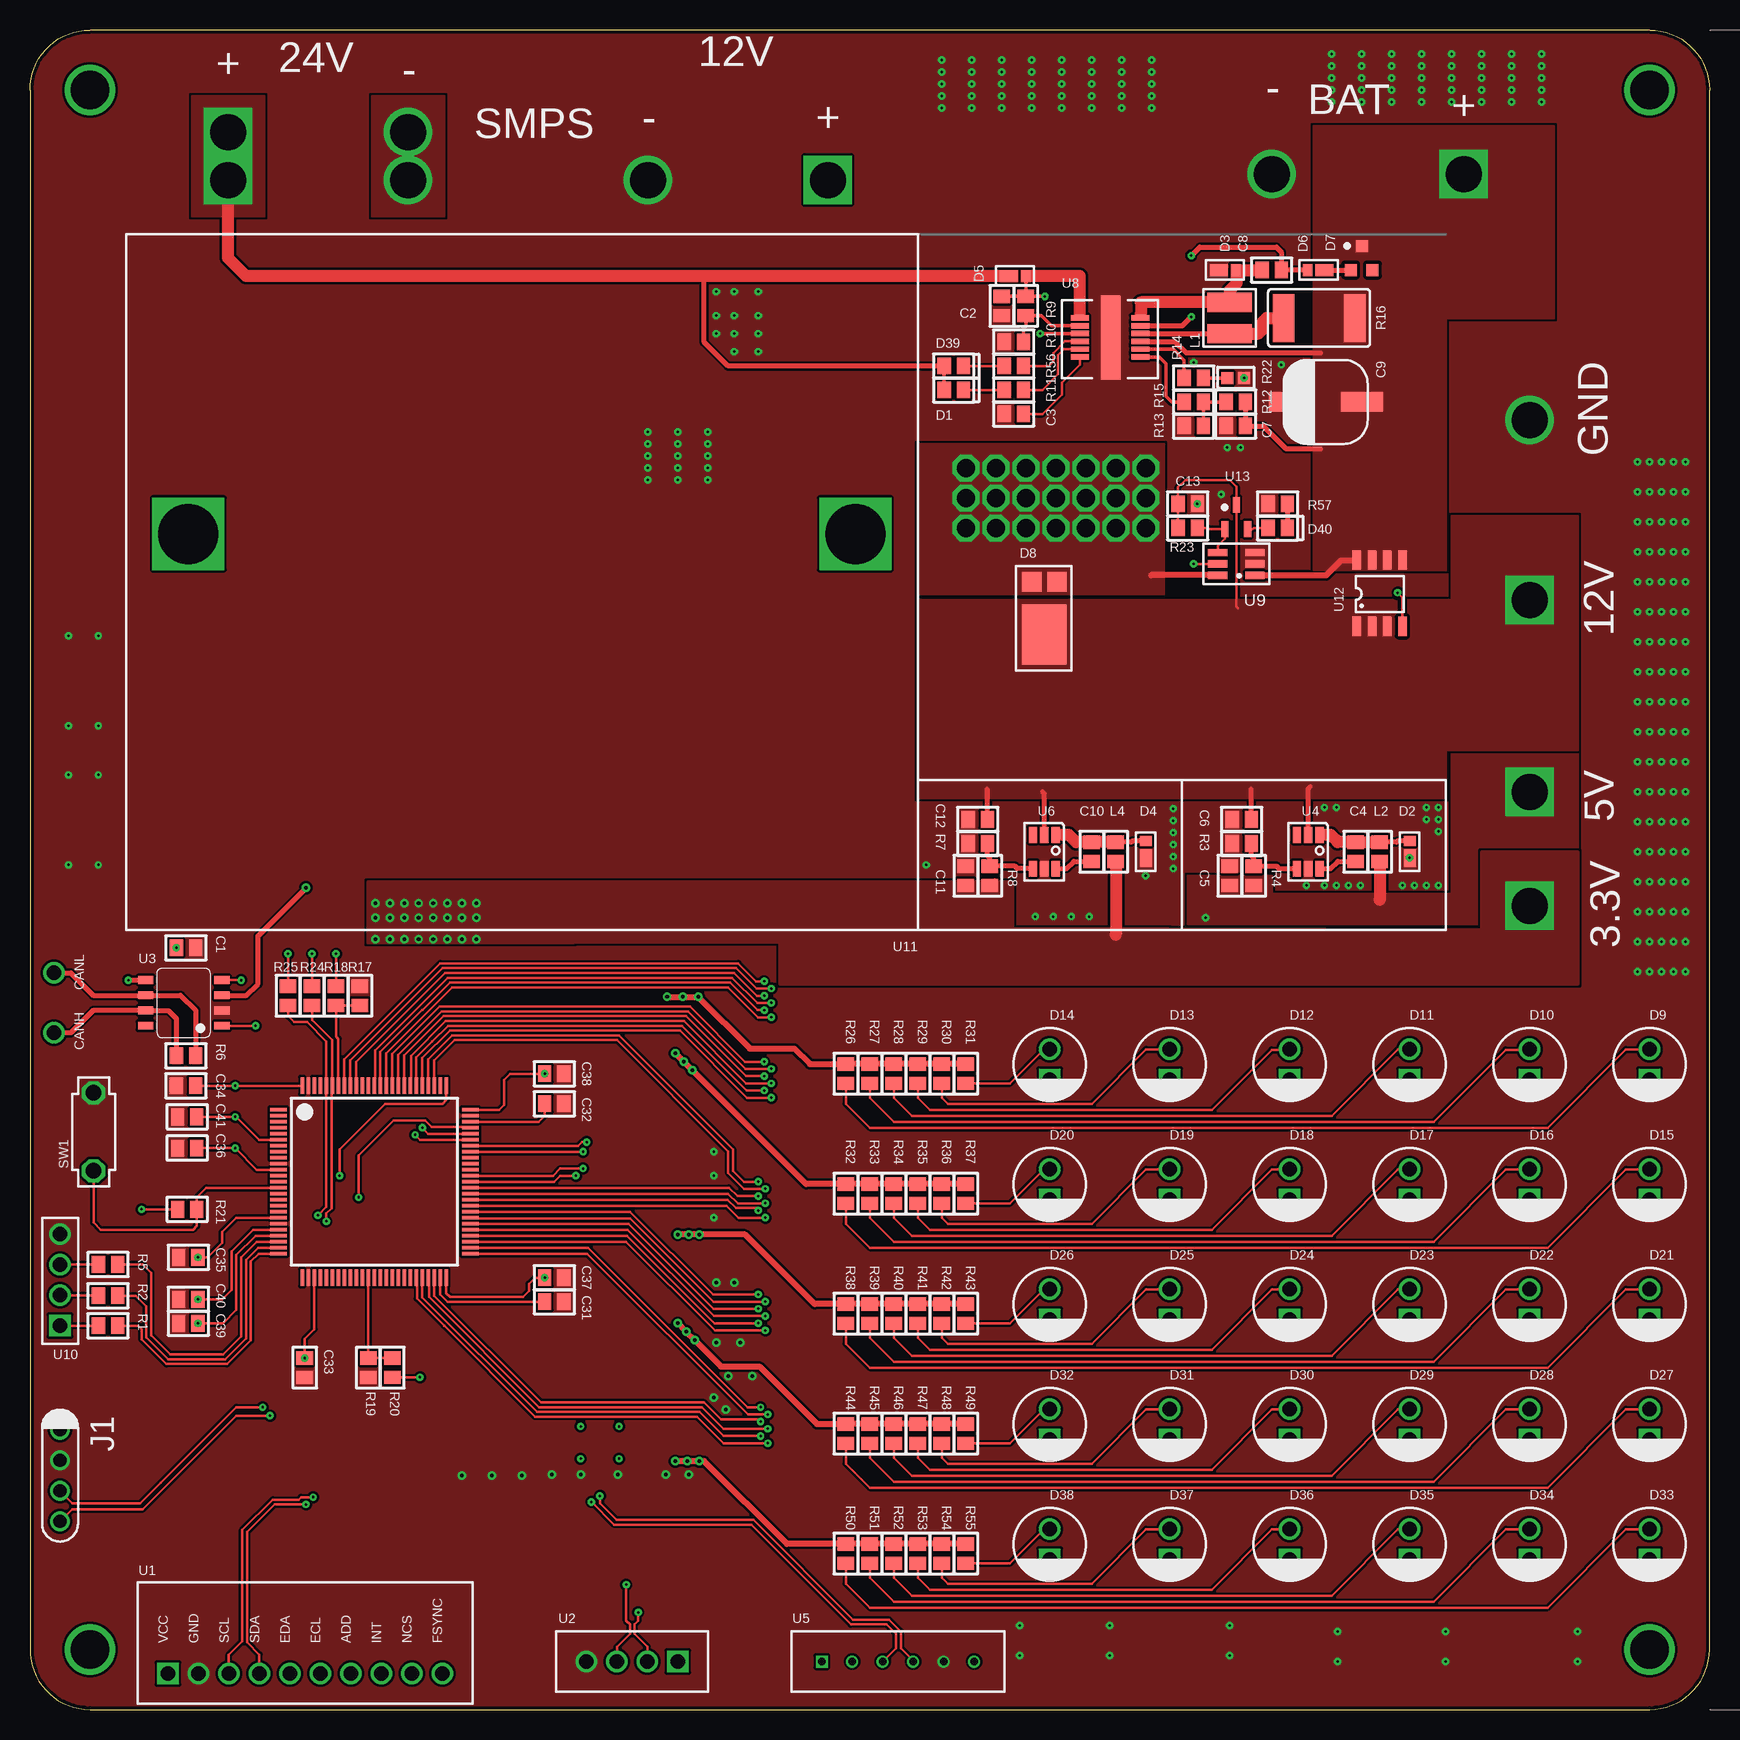
[diagram p7: board, top side]
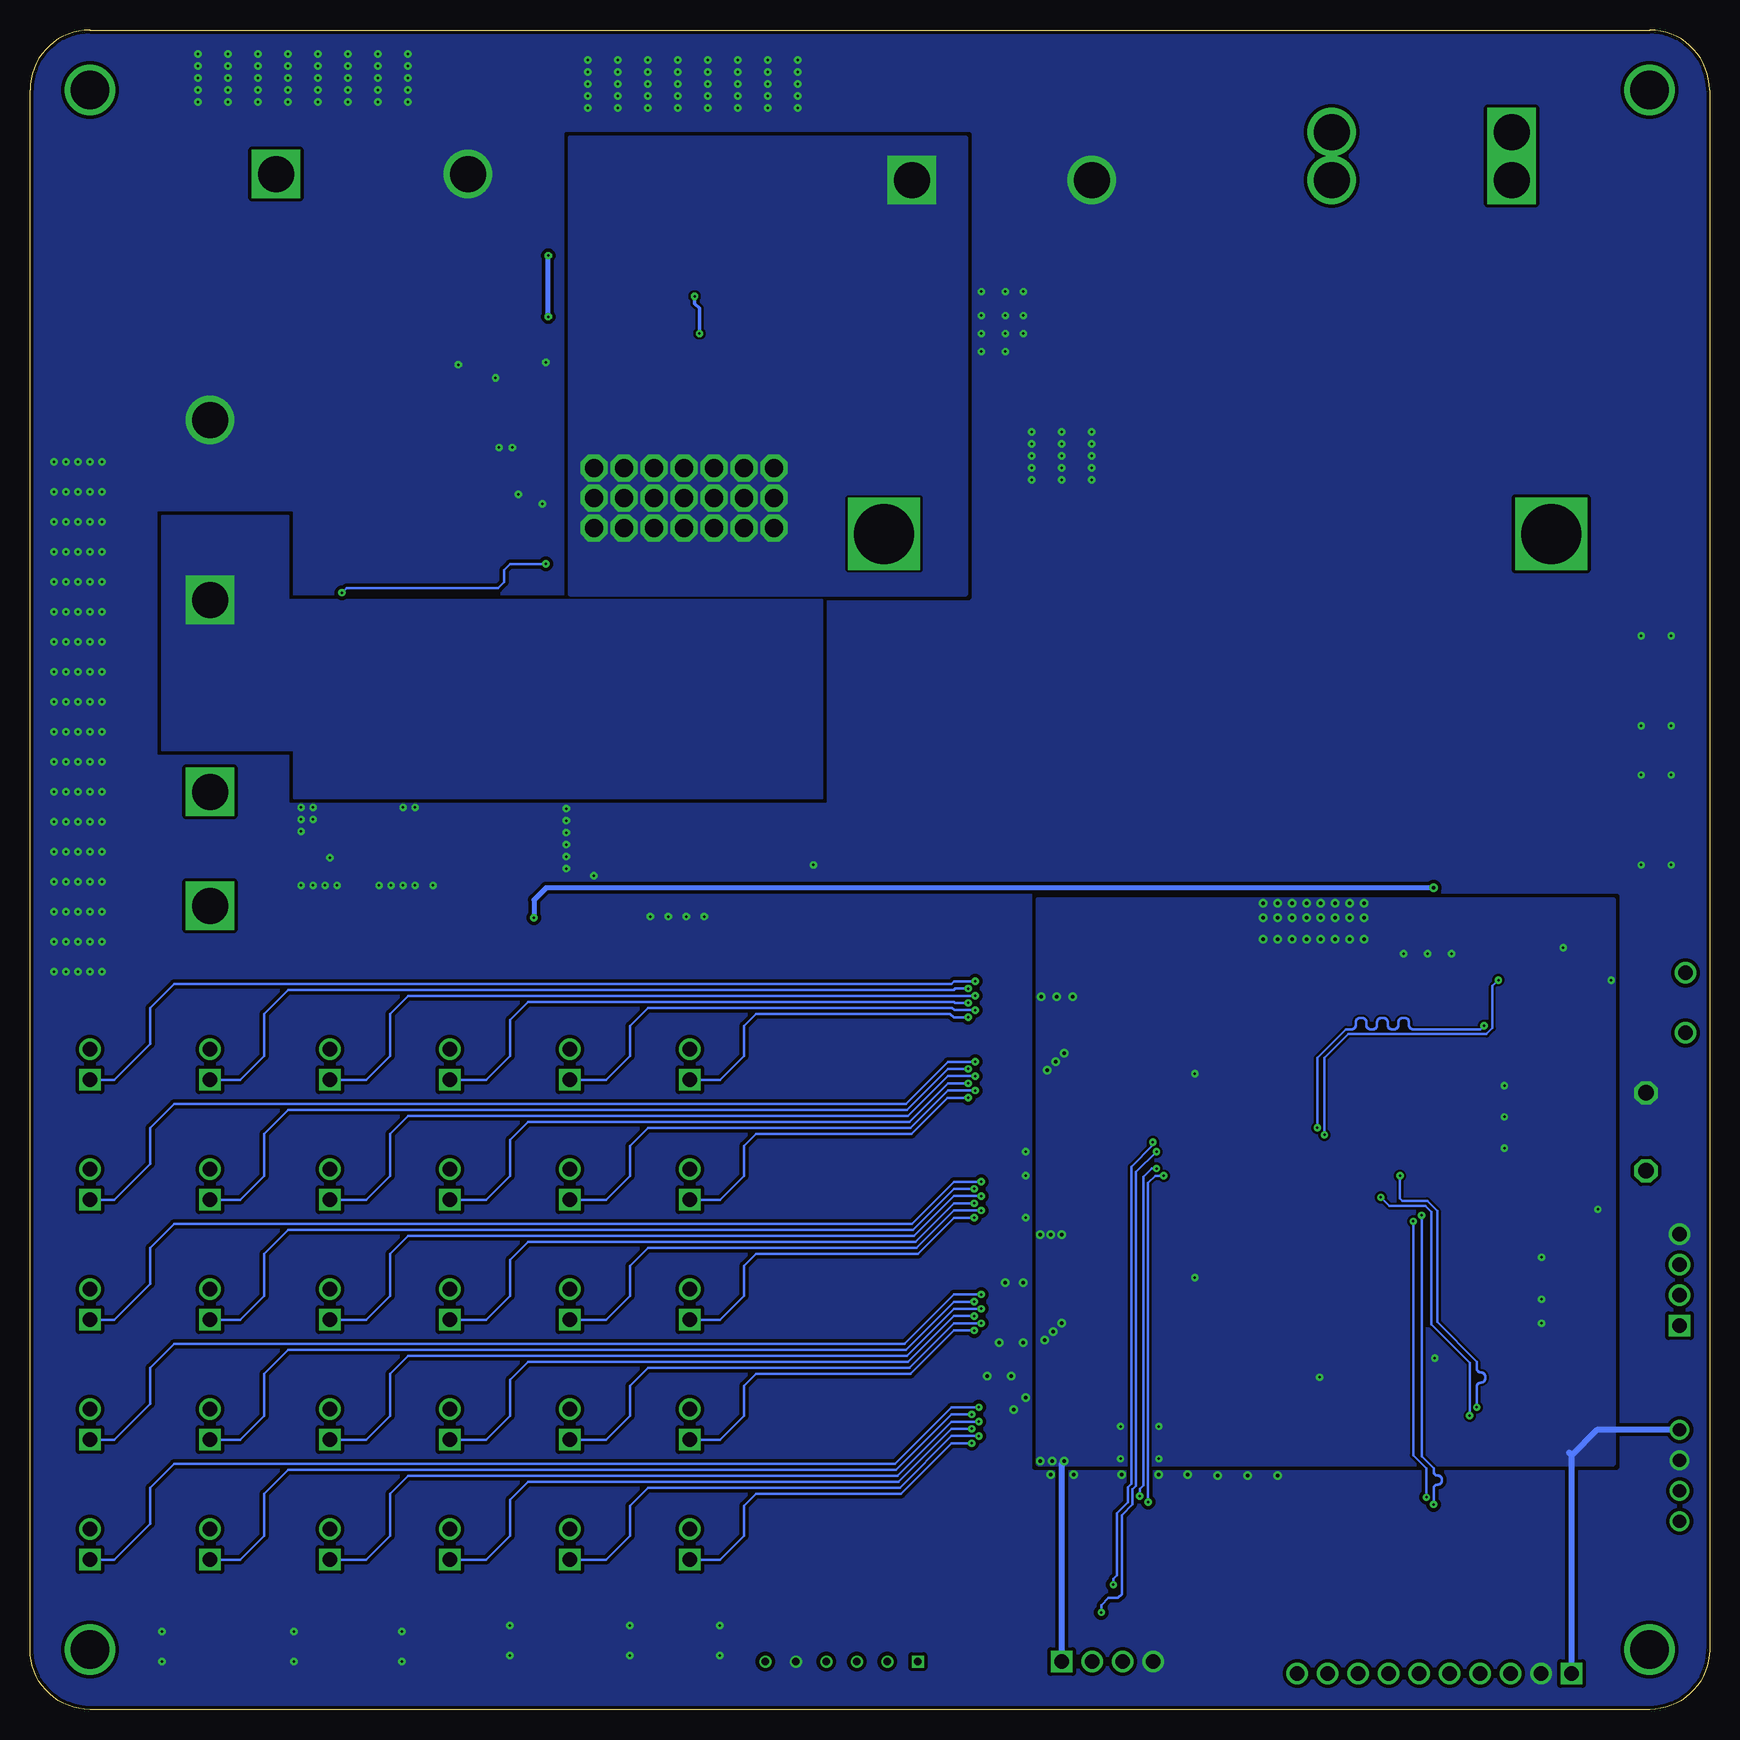
[diagram p8: board, bottom side, seen from below]

Size 140 x 140 mm. Coordinates in mm from the lower left corner, seen from the top.
Outline: 5,0 135,0 arc90 140,5 140,135 arc90 135,140 5,140 arc90 0,135 0,5 arc90 5,0
Copper layers (1*2*15*16): Top 0.035mm / dielectric 0.2mm / Route2 0.035mm / dielectric 1.06mm / Route15 0.035mm / dielectric 0.2mm / Bottom 0.035mm
Design rules "hsdgt3_1oz": minimum track width 0.2mm, minimum drill 0.2mm, track to track 0.2mm, track to pad 0.2mm, pad to pad 0.2mm, via to via 0.2mm, smd to smd 0mil, copper to edge 0.3mm, drill to drill 8mil, minimum pad ring 0.2mm, minimum via ring 0.2mm, stop-mask expansion 0mil, vias tented up to drill 0.3mm, thermal gap 10mil

### Footprints (pad centres in the part's own frame; a part is rotated, then mirrored left to right if it is on the bottom)
2012 = smd 1.4 x 1.1: P$1 0,0.8; P$2 0,-0.8
F55_SIZE(SMD) = smd 3.5 x 1.6: GND -3,0; VCC 3,0
2012' = smd 1.1 x 1.4: A -0.8,0; K 0.8,0
DSN2(1608) = smd 1.5 x 1: A 1.4,0 | smd 0.8 x 1: K 0,0
SOT-23 = smd 1 x 1: P$1 -0.9,-2; P$2 0.9,-2; P$3 0,0
POWERDI5 = smd 1.6 x 1.6: A$1 0,2.1; A$2 0,0 | smd 5 x 3.7: K 4.4,1.05
DIP_5MM = drill 1.2: A 0,2.54 | drill 1.2 square: K 0,0
4PIN = drill 1.1: P$1 -3.81,0; P$2 -1.27,0; P$3 1.27,0; P$4 3.81,0
4040SIZE = smd 1.6 x 3.7: P$1 1.3,0; P$2 -1.3,0
6432 = smd 1.8 x 4: P$1 -3,0; P$2 2.9,0
1608 = smd 1 x 1: P$1 0,0.7; P$2 0,-0.7
6.5PITCH = drill 1.3 octagon: P$1 0,0; P$2 6.5,0
GY-9250 = drill 1.2 square: P$1 0,0 | drill 1.2: P$2 0,-2.54; P$3 0,-5.08; P$4 0,-7.62; P$5 0,-10.16; P$6 0,-12.7; P$7 0,-15.24; P$8 0,-17.78; P$9 0,-22.86; P$10 0,-20.32
PAD_2.5MM = drill 1.2 square: P$1 0,0 | drill 1.2: P$2 0,-2.54; P$3 0,-5.08; P$4 0,-7.62
PG-DSO-8 = smd 1.27 x 0.635: P1 0,0; P2 0,-1.27; P3 0,-2.54; P4 0,-3.81; P5 6.35,-3.81; P6 6.35,-2.54; P7 6.35,-1.27; P8 6.35,0
SOT-23-6 = smd 1.3 x 0.7: 1 0.1,0; 2 0.1,-0.95; 3 0.1,-1.9; 4 2.9,-1.9; 5 2.9,-0.95; 6 2.9,0
CP2102-6PIN = drill 0.6 square: P$1 0,0 | drill 0.6: P$2 0,-2.54; P$3 0,-5.08; P$4 0,-7.62; P$5 0,-10.16; P$6 0,-12.7
LQFP100 = smd 0.3 x 1.4: P$1 -6,-8; P$2 -5.5,-8; P$3 -5,-8; P$4 -4.5,-8; P$5 -4,-8; P$6 -3.5,-8; P$7 -3,-8; P$8 -2.5,-8; P$9 -2,-8; P$10 -1.5,-8; P$11 -1,-8; P$12 -0.5,-8; P$13 0,-8; P$14 0.5,-8; P$15 1,-8; P$16 1.5,-8; P$17 2,-8; P$18 2.5,-8; P$19 3,-8; P$20 3.5,-8; P$21 4,-8; P$22 4.5,-8; P$23 5,-8; P$24 5.5,-8; P$25 6,-8; P$51 6,8; P$52 5.5,8; P$53 5,8; P$54 4.5,8; P$55 4,8; P$56 3.5,8; P$57 3,8; P$58 2.5,8; P$59 2,8; P$60 1.5,8; P$61 1,8; P$62 0.5,8; P$63 0,8; P$64 -0.5,8; P$65 -1,8; P$66 -1.5,8; P$67 -2,8; P$68 -2.5,8; P$69 -3,8; P$70 -3.5,8; P$71 -4,8; P$72 -4.5,8; P$73 -5,8; P$74 -5.5,8; P$75 -6,8 | smd 1.4 x 0.3: P$26 8,-6; P$27 8,-5.5; P$28 8,-5; P$29 8,-4.5; P$30 8,-4; P$31 8,-3.5; P$32 8,-3; P$33 8,-2.5; P$34 8,-2; P$35 8,-1.5; P$36 8,-1; P$37 8,-0.5; P$38 8,0; P$39 8,0.5; P$40 8,1; P$41 8,1.5; P$42 8,2; P$43 8,2.5; P$44 8,3; P$45 8,3.5; P$46 8,4; P$47 8,4.5; P$48 8,5; P$49 8,5.5; P$50 8,6; P$76 -8,6; P$77 -8,5.5; P$78 -8,5; P$79 -8,4.5; P$80 -8,4; P$81 -8,3.5; P$82 -8,3; P$83 -8,2.5; P$84 -8,2; P$85 -8,1.5; P$86 -8,1; P$87 -8,0.5; P$88 -8,0; P$89 -8,-0.5; P$90 -8,-1; P$91 -8,-1.5; P$92 -8,-2; P$93 -8,-2.5; P$94 -8,-3; P$95 -8,-3.5; P$96 -8,-4; P$97 -8,-4.5; P$98 -8,-5; P$99 -8,-5.5; P$100 -8,-6
MSOP-12 = smd 0.45 x 1.5: P$1 0,0; P$2 0.65,0; P$3 1.3,0; P$4 1.95,0; P$5 2.6,0; P$6 3.25,0; P$7 3.25,5.05; P$8 2.6,5.05; P$9 1.95,5.05; P$10 1.3,5.05; P$11 0.65,5.05; P$12 0,5.05 | smd 7 x 1.65: P$13 1.625,2.575
TSOT-23(3X3) = smd 0.6 x 1.6: P$1 -0.95,-1.6; P$2 0,-1.6; P$3 0.95,-1.6; P$4 0.95,1.5; P$5 0,1.5; P$6 -0.95,1.5
RGB_4PIN_2.5MM = drill 1.2 square: P$1 0,0 | drill 1.2: P$2 0,-2.54; P$3 0,-5.08; P$4 0,-7.62
24V_12V_10A = drill 3 square: 12V+ 7.5,-4.5; 24V+ 57.5,-4.5; 24V+$1 57.5,-8.5 | drill 3: 12V- 22.5,-4.5; 24V- 42.5,-4.5; 24V-$1 42.5,-8.5 | drill 5 square: P$1 5.2,25; P$2 60.8,25
SO-8 = smd 0.7 x 1.6: 1 -1.905,-2.705; 2 -0.635,-2.705; 3 0.635,-2.705; 4 1.905,-2.705; 5 1.905,2.805; 6 0.635,2.805; 7 -0.635,2.805; 8 -1.905,2.805
SOT-23-3 = smd 0.6 x 1.3: 1 -0.9,-0.6; 2 1,-0.6; 3 0.05,1.43

### Placement (x,y rotation side)
C1  13,63.5 270 top
C2  81,117 180 top
C3  82,108 90 top
C4  110.5,71.5 180 top
C5  100,69.5 0 top
C6  101,74.2 90 top
C7  100.5,107 90 top
C8  103.5,120 270 top
C9  108,109 0 top
C10  88.5,71.5 180 top
C11  78,69.5 0 top
C12  79,74.2 90 top
C13  96.5,100.5 270 top
C31  43.7,34 90 top
C32  43.7,50.5 90 top
C33  22.9,28.5 180 top
C34  13,52 90 top
C35  13.2,37.7 90 top
C36  13.1,46.8 90 top
C37  43.7,36 270 top
C38  43.7,53 270 top
C39  13.2,32.2 90 top
C40  13.2,34.2 90 top
C41  13.1,49.4 90 top
D1  [2012']  77,110 0 top
D2  115,72.4 270 top
D3  100.5,120 180 top
D4  93,72.4 270 top
D5  83,119.5 180 top
D6  106.5,120 0 top
D7  111,122 0 top
D8  83.5,94 270 top
D9  135,52.5 0 top
D10  125,52.5 0 top
D11  115,52.5 0 top
D12  105,52.5 0 top
D13  95,52.5 0 top
D14  85,52.5 0 top
D15  135,42.5 0 top
D16  125,42.5 0 top
D17  115,42.5 0 top
D18  105,42.5 0 top
D19  95,42.5 0 top
D20  85,42.5 0 top
D21  135,32.5 0 top
D22  125,32.5 0 top
D23  115,32.5 0 top
D24  105,32.5 0 top
D25  95,32.5 0 top
D26  85,32.5 0 top
D27  135,22.5 0 top
D28  125,22.5 0 top
D29  115,22.5 0 top
D30  105,22.5 0 top
D31  95,22.5 0 top
D32  85,22.5 0 top
D33  135,12.5 0 top
D34  125,12.5 0 top
D35  115,12.5 0 top
D36  105,12.5 0 top
D37  95,12.5 0 top
D38  85,12.5 0 top
D39  [2012']  77,112 0 top
D40  [2012']  104,98.5 0 top
J1  2.5,19.5 270 top
L1  100,116 270 top
L2  112.5,71.5 0 top
L4  90.5,71.5 0 top
R1  6.5,32 270 top
R2  6.5,34.5 270 top
R3  101,72.2 90 top
R4  102,69.5 0 top
R5  6.5,37.1 270 top
R6  13,54.5 270 top
R7  79,72.2 90 top
R8  80,69.5 0 top
R9  83,117 180 top
R10  82,114 90 top
R11  82,110 270 top
R12  100.5,109 90 top
R13  97,107 90 top
R14  97,111 270 top
R15  97,109 270 top
R16  107.5,116 0 top
R17  27.5,59.5 0 top
R18  25.5,59.5 180 top
R19  28.2,28.5 180 top
R20  30.2,28.5 0 top
R21  13.1,41.7 270 top
R22  100.5,111 270 top
R23  96.5,98.5 270 top
R24  23.5,59.5 180 top
R25  21.5,59.5 180 top
R26  68,53 0 top
R27  70,53 0 top
R28  72,53 0 top
R29  74,53 0 top
R30  76,53 0 top
R31  78,53 0 top
R32  68,43 0 top
R33  70,43 0 top
R34  72,43 0 top
R35  74,43 0 top
R36  76,43 0 top
R37  78,43 0 top
R38  68,33 0 top
R39  70,33 0 top
R40  72,33 0 top
R41  74,33 0 top
R42  76,33 0 top
R43  78,33 0 top
R44  68,23 0 top
R45  70,23 0 top
R46  72,23 0 top
R47  74,23 0 top
R48  76,23 0 top
R49  78,23 0 top
R50  68,13 0 top
R51  70,13 0 top
R52  72,13 0 top
R53  74,13 0 top
R54  76,13 0 top
R55  78,13 0 top
R56  82,112 270 top
R57  104,100.5 90 top
SW1  5.3,44.9 90 top
U1  11.5,3 90 top
U2  54,4 270 top
U3  16,57 180 top
U4  107.5,73 270 top
U5  66,4 90 top
U6  85.5,73 270 top
U7  28.7,44 270 top
U8  87.5,116 270 top
U9  100.5,95.5 90 top
U10  2.5,32 180 top
U11  74,123 180 top
U12  112.5,93 0 top
U13  100.5,99 0 top

### Tracks (layer width: path | path; a pad name or v marks a point on that pad's centre or on a via)
12V  (via drill 3)
  Top 0.2: 100.7,91.8 100.55,91.95 U13.3 100.55,101.95 100,102.5 96.3,102.5 95.7,101.9 C13.P$2 R23.P$2
  Top 0.4: C12.P$2 79.8,76.7 | U6.2 84.55,76.35 84.4,76.5 | C6.P$2 101.8,76.7 | U4.2 106.55,76.75 106.7,76.9
  other vias: 125,92.5
  pour Top (isolate 0.3, rank 2, no thermals): 129,80 129,99.5 118.5,99.5 118.5,92.5 74,92.5 74,76 118,76 118,80
  pour Bottom (isolate 0.3, rank 2, no thermals): 129,80 129,99.5 118.5,99.5 118.5,92.5 74,92.5 74,76 118,76 118,80
24V
  Top 0.3: D1.A D39.A | 76.2,119.3 76,119.5
  Top 0.4: D39.A 58.2,112 56.2,114 56.2,119.5
  Top 1: D5.A 76,119.5 56.2,119.5 18,119.5 16.5,121 U11.24V+
  pour Top (isolate 0.5, rank 2, no thermals): 13.5,134.5 19.5,134.5 19.5,124.5 13.5,124.5
!CHRG!
  Top 0.2: R56.P$1 84.93,112 85.3,112.37 85.3,113.07 86.28,114.05 U8.P$4
!FAULT!
  Top 0.2: U8.P$5 86.2,113.4 85.7,112.9 85.7,111.3 84.4,110 R11.P$1
!NRST
  Top 0.2: SW1.P$1 5.3,40.6 5.9,40 13.6,40 13.9,40.3 R21.P$1 13.9,42.7 14.7,43.5 U7.P$14
BOOT4
  Top 0.2: R20.P$1 R19.P$2 U7.P$37
BOOT5
  Top 0.2: 25.8,58.7 R18.P$1 25.5,56.1 25.7,55.9 U7.P$94 | 25.8,58.7 R17.P$2 | 25.7,58.6 25.8,58.7
CAN_RX  (via drill 0.2)
  Top 0.2: U3.P4 v17.6,60.8 | U7.P$70 32.5,47.5 v32.1,47.9
  Bottom 0.2: v32.1,47.9 32.1,54.3 30.1,56.3 18.6,56.3 18.1,56.8 18.1,60.3 v17.6,60.8
CAN_TX  (via drill 0.2)
  Top 0.2: U7.P$71 33.2,48 v32.7,48.5 | U3.P1 v18.8,57
  Bottom 0.2: v32.7,48.5 32.7,54.3 30.3,56.7 29.84,56.7 arc-90 29.49,57.05 29.49,57.29 arc90 29.14,57.64 28.95,57.64 arc90 28.6,57.29 28.6,57.05 arc-90 28.25,56.7 28.06,56.7 arc-90 27.71,57.05 27.71,57.29 arc90 27.36,57.64 27.18,57.64 arc90 26.82,57.29 26.82,57.05 arc-90 26.48,56.7 26.29,56.7 arc-90 25.94,57.05 25.94,57.29 arc90 25.59,57.64 25.4,57.64 arc90 25.05,57.29 25.05,57.05 arc-90 24.7,56.7 19.1,56.7 v18.8,57
CANH  (via drill 1.2)
  Top 0.4: R6.P$2 12.2,57.6 11.53,58.27 U3.P7 5.27,58.27 3.4,56.4 v2,56.4
CANL  (via drill 1.2)
  Top 0.4: R6.P$1 13.8,58.3 12.56,59.54 U3.P6 5.26,59.54 3.4,61.4 v2,61.4
DGND  (via drill 0.2, 0.3, 3)
  other vias: 125,107.5 58.2,27.8 57.2,35.6 103.5,128 97.3,100.5 99.3,101.3 99.8,105.2 100.9,105.2 101.2,111 104.3,112.1 97,112.3 115,71 93,69.5 88.3,66.1 74.7,70.4 60.7,116.2 129,6.5 129,4 118,6.5 118,4 109,6.5 109,4 100,7 100,4.5 90,7 90,4.5 82.5,7 82.5,4.5 138,64 138,61.5 137,64 137,61.5 136,64 136,61.5 135,64 135,61.5 134,64 134,61.5 138,69 138,66.5 137,69 137,66.5 136,69 136,66.5 135,69 135,66.5 134,69 134,66.5 138,74 138,71.5 137,74 137,71.5 136,74 136,71.5 135,74 135,71.5 134,74 134,71.5 138,79 138,76.5 137,79 137,76.5 136,79 136,76.5 135,79 135,76.5 134,79 134,76.5 138,84 138,81.5 137,84 137,81.5 136,84 136,81.5 135,84 135,81.5 134,84 134,81.5 138,89 138,86.5 137,89 137,86.5 136,89 136,86.5 135,89 135,86.5 134,89 134,86.5 138,94 138,91.5 137,94 137,91.5 136,94 136,91.5 135,94 135,91.5 134,94 134,91.5 138,99 138,96.5 137,99 137,96.5 136,99 136,96.5 135,99 135,96.5 134,99 134,96.5 138,104 138,101.5 137,104 137,101.5 136,104 136,101.5 135,104 135,101.5 134,104 134,101.5 57,46.5 57,44.5 57,41 58.7,35.6 57.2,30.6 59.2,30.6 60.2,27.8 45.9,19.6 49,19.6 54.9,19.6 53,19.6 43.5,19.6 3.2,77.9 5.7,77.9 3.2,70.4 5.7,70.4 3.2,89.5 5.7,89.5 3.2,82 5.7,82 123.5,138 126,138 123.5,137 126,137 123.5,136 126,136 123.5,135 126,135 123.5,134 126,134 118.5,138 121,138 118.5,137 121,137 118.5,136 121,136 118.5,135 121,135 118.5,134 121,134 113.5,138 116,138 113.5,137 116,137 113.5,136 116,136 113.5,135 116,135 113.5,134 116,134 108.5,138 111,138 108.5,137 111,137 108.5,136 111,136 108.5,135 111,135 108.5,134 111,134 91,137.5 93.5,137.5 91,136.5 93.5,136.5 91,135.5 93.5,135.5 91,134.5 93.5,134.5 91,133.5 93.5,133.5 86,137.5 88.5,137.5 86,136.5 88.5,136.5 86,135.5 88.5,135.5 86,134.5 88.5,134.5 86,133.5 88.5,133.5 81,137.5 83.5,137.5 81,136.5 83.5,136.5 81,135.5 83.5,135.5 81,134.5 83.5,134.5 81,133.5 83.5,133.5 76,137.5 78.5,137.5 76,136.5 78.5,136.5 76,135.5 78.5,135.5 76,134.5 78.5,134.5 76,133.5 78.5,133.5 57.2,118.2 60.7,118.2 57.2,116.2 57.2,114.7 58.7,113.2 60.7,113.2 60.7,114.7 58.7,114.7 58.7,116.2 58.7,118.2 56.5,106.5 56.5,105.5 56.5,104.5 56.5,103.5 56.5,102.5 51.5,106.5 54,106.5 51.5,105.5 54,105.5 51.5,104.5 54,104.5 51.5,103.5 54,103.5 51.5,102.5 54,102.5 58,25 57,26 41,19.5 38.5,19.5 36,19.5 86.8,66.1 85.3,66.1 83.8,66.1 110.9,68.7 109.9,68.7 108.9,68.7 107.9,68.7 106.4,68.7 114.4,68.7 115.4,68.7 116.4,68.7 117.4,68.7 117.4,75.2 107.9,75.2 108.9,75.2 117.4,74.2 116.4,74.2 116.4,75.2 117.4,73.2 95.3,75.1 95.3,74.1 95.3,73.1 95.3,72.1 95.3,71.1 95.3,70.1
  pour Bottom (isolate 0.3, rank 4, no thermals): 0,140 0,0 140,0 140,140
  pour Top (isolate 0.2, rank 6, no thermals): 0,140 0,0 140,0 140,140
EXT.GND
  pour Top (isolate 0.5, rank 2, no thermals): 28.5,134.5 34.5,134.5 34.5,124.5 28.5,124.5
GPS_RX_UART_TX  (via drill 0.2)
  Top 0.2: U2.P$2 51.46,5.24 50.4,6.3 50.4,7.1 50.7,7.4 v50.7,8.1 | U7.P$68 v46.1,46.5
  Bottom 0.2: v46.1,46.5 47.8,44.8 47.8,44.3 47.8,18.67 48.1,18.37 48.1,17.1 49,16.2 49,9.6 49.3,9.3 50.1,9.3 50.7,8.7 v50.7,8.1
GPS_TX_UART_RX  (via drill 0.2)
  Top 0.2: U2.P$3 48.92,5.22 50,6.3 50,7.1 49.7,7.4 v49.7,10.4 | U7.P$69 45.7,47 46,47.3 v46.4,47.3
  Bottom 0.2: v46.4,47.3 46.4,47.05 48.2,45.25 48.2,44.1 48.2,43.7 48.2,18.83 48.5,18.53 48.5,17.27 49.4,16.37 49.4,11.2 49.7,10.9 v49.7,10.4
IMU_SCL  (via drill 0.2)
  Top 0.2: R24.P$1 23.5,57.5 25.2,55.8 U7.P$95 25.15,51.95 25.15,41.78 24.7,41.33 v24.7,40.7 | U1.P$3 16.58,4.58 17.7,5.7 17.7,14.97 20.23,17.5 22.4,17.5 22.6,17.7 v23.6,17.7
  Bottom 0.2: v24.7,40.7 24.7,21.2 23.6,20.1 v23.6,17.7
IMU_SDA  (via drill 0.2)
  Top 0.2: R25.P$1 21.5,57.8 22,57.3 23.1,57.3 24.7,55.7 U7.P$96 24.7,41.9 v24,41.2 | U1.P$4 19.12,4.58 18.1,5.6 18.1,14.8 20.4,17.1 v23,17.1
  Bottom 0.2: v24,41.2 24,21.1 23,20.1 23,19.86 arc-90 22.65,19.5 arc90 22.3,19.16 22.3,19.1 arc90 22.65,18.75 arc-90 23,18.4 v23,17.1
LED_B
  Top 0.2: U7.P$23 18.9,39 17.6,37.7 17.6,31.1 16.1,29.6 11.7,29.6 10.1,31.2 10.1,36.4 9.4,37.1 R5.P$1
LED_G
  Top 0.2: U7.P$24 19,38.5 18,37.5 18,30.93 16.27,29.2 11.53,29.2 9.7,31.03 9.7,33.6 8.8,34.5 R2.P$1
LED_R
  Top 0.2: R1.P$1 9,32 9.3,31.7 9.3,30.87 11.37,28.8 16.43,28.8 18.4,30.77 18.4,37.33 19.07,38 U7.P$25
LED_STAT1  (via drill 0.2)
  Top 0.2: U7.P$93 26.2,54.2 34.2,62.2 59.03,62.2 60.53,60.7 v61.2,60.7
  Bottom 0.2: D9.K 133,52.5 130,55.5 130,58.5 128,60.5 63.2,60.5 63,60.7 v61.2,60.7
LED_STAT2  (via drill 0.2)
  Top 0.2: U7.P$92 26.7,54.1 34.4,61.8 58.86,61.8 60.56,60.1 v61.8,60.1
  Bottom 0.2: D10.K 122.5,52.5 120.5,54.5 120.5,58 118.5,60 63,60 62.9,60.1 v61.8,60.1
LED_STAT3  (via drill 0.2)
  Top 0.2: U7.P$91 27.2,54 34.6,61.4 58.7,61.4 60.6,59.5 v61.2,59.5
  Bottom 0.2: D11.K 112,52.5 110,54.5 110,58 108.5,59.5 v61.2,59.5
LED_STAT4  (via drill 0.2)
  Top 0.2: U7.P$88 28.75,52.05 28.75,54.95 34.8,61 34.87,61 34.9,61 58.53,61 60.63,58.9 v61.8,58.9
  Bottom 0.2: D12.K 102,52.5 100,54.5 100,57.5 98.5,59 63,59 62.9,58.9 v61.8,58.9
LED_STAT5  (via drill 0.2)
  Top 0.2: U7.P$87 29.2,54.8 32.7,58.3 32.73,58.3 35.03,60.6 58.37,60.6 60.67,58.3 v61.2,58.3
  Bottom 0.2: D13.K 92,52.5 90,54.5 90,57 88.5,58.5 63.15,58.5 62.95,58.3 v61.2,58.3
LED_STAT6  (via drill 0.2)
  Top 0.2: U7.P$86 29.7,54.7 35.2,60.2 58.2,60.2 60.7,57.7 v61.8,57.7
  Bottom 0.2: D14.K 82.5,52.5 80.5,54.5 80.5,57 79.5,58 63.3,58 63,57.7 v61.8,57.7
LED_STAT7  (via drill 0.2)
  Top 0.2: U7.P$85 30.2,54.63 34.17,58.6 55,58.6 59.6,54 v61.2,54
  Bottom 0.2: D15.K 133,42.5 130,45.5 130,48.5 128,50.5 67,50.5 63.5,54 v61.2,54
LED_STAT8  (via drill 0.2)
  Top 0.2: U7.P$84 30.7,54.57 34.33,58.2 54.83,58.2 59.63,53.4 v61.8,53.4
  Bottom 0.2: D16.K 122.5,42.5 120.5,44.5 120.5,48 118.5,50 66.9,50 63.5,53.4 v61.8,53.4
LED_STAT9  (via drill 0.2)
  Top 0.2: U7.P$83 31.2,54.5 34.5,57.8 54.67,57.8 59.67,52.8 v61.2,52.8
  Bottom 0.2: D17.K 112,42.5 110,44.5 110,48 108.5,49.5 66.8,49.5 63.5,52.8 v61.2,52.8
LED_STAT10  (via drill 0.2)
  Top 0.2: U7.P$82 31.75,52.05 31.75,54.49 34.66,57.4 54.5,57.4 59.7,52.2 v61.8,52.2
  Bottom 0.2: D18.K 102,42.5 100,44.5 100,47.5 98.5,49 66.7,49 63.5,52.2 v61.8,52.2
LED_STAT11  (via drill 0.2)
  Top 0.2: U7.P$81 32.2,54.37 33.53,55.7 34.83,57 54.34,57 59.74,51.6 v61.2,51.6
  Bottom 0.2: D19.K 92,42.5 90,44.5 90,47 88.5,48.5 66.6,48.5 63.5,51.6 v61.2,51.6
LED_STAT12  (via drill 0.2)
  Top 0.2: v61.8,51 59.77,51 54.17,56.6 35,56.6 32.7,54.3 U7.P$80
  Bottom 0.2: D20.K 82.5,42.5 80.5,44.5 80.5,47 79.5,48 66.53,48 63.53,51 v61.8,51
LED_STAT13  (via drill 0.2)
  Top 0.2: U7.P$79 33.2,54.2 35.2,56.2 35.23,56.2 35.6,56.2 49.1,56.2 58.6,46.7 58.6,44.9 59.5,44 v60.7,44
  Bottom 0.2: D21.K 133,32.5 130,35.5 130,38.5 128,40.5 66.5,40.5 63,44 v60.7,44
LED_STAT14  (via drill 0.2)
  Top 0.2: U7.P$78 33.7,54.1 35.4,55.8 48.93,55.8 58.2,46.53 58.2,44.73 59.53,43.4 v61.3,43.4
  Bottom 0.2: D22.K 122.5,32.5 120.5,34.5 120.5,38 118.5,40 66.4,40 63,43.4 v61.3,43.4
LED_STAT15  (via drill 0.2)
  Top 0.2: v60.7,42.8 58.97,42.8 58.27,43.5 U7.P$62
  Bottom 0.2: D23.K 112,32.5 110,34.5 110,38 108.5,39.5 66.3,39.5 63,42.8 v60.7,42.8
LED_STAT16  (via drill 0.2)
  Top 0.2: v61.3,42.2 59,42.2 58.2,43 U7.P$61
  Bottom 0.2: D24.K 102,32.5 100,34.5 100,37.5 98.5,39 66.2,39 63,42.2 v61.3,42.2
LED_STAT17  (via drill 0.2)
  Top 0.2: v60.7,41.6 60.5,41.8 58.84,41.8 58.14,42.5 U7.P$60
  Bottom 0.2: D25.K 92,32.5 90,34.5 90,37 88.5,38.5 66.1,38.5 63,41.6 v60.7,41.6
LED_STAT18  (via drill 0.2)
  Top 0.2: v61.3,41 59.07,41 58.07,42 U7.P$59
  Bottom 0.2: D26.K 82.5,32.5 80.5,34.5 80.5,37 79.5,38 66,38 63,41 v61.3,41
LED_STAT19  (via drill 0.2)
  Top 0.2: v60.7,34.6 56.93,34.6 50.03,41.5 U7.P$58
  Bottom 0.2: D27.K 133,22.5 130,25.5 130,28.5 128,30.5 67.1,30.5 63,34.6 v60.7,34.6
LED_STAT20  (via drill 0.2)
  Top 0.2: U7.P$57 36.75,40.95 50.01,40.95 56.96,34 v61.3,34
  Bottom 0.2: D28.K 122.5,22.5 120.5,24.5 120.5,28 118.5,30 67,30 63,34 v61.3,34
LED_STAT21  (via drill 0.2)
  Top 0.2: v60.7,33.4 57,33.4 49.9,40.5 U7.P$56
  Bottom 0.2: D29.K 112,22.5 110,24.5 110,28 108.5,29.5 66.9,29.5 63,33.4 v60.7,33.4
LED_STAT22  (via drill 0.2)
  Top 0.2: v61.3,32.8 57.03,32.8 49.83,40 U7.P$55
  Bottom 0.2: D30.K 102,22.5 100,24.5 100,27.5 98.5,29 66.8,29 63,32.8 v61.3,32.8
LED_STAT23  (via drill 0.2)
  Top 0.2: v60.7,32.2 57.07,32.2 49.77,39.5 U7.P$54
  Bottom 0.2: D31.K 92,22.5 90,24.5 90,27 88.5,28.5 66.7,28.5 63,32.2 v60.7,32.2
LED_STAT24  (via drill 0.2)
  Top 0.2: U7.P$53 49.7,39 57.1,31.6 v61.3,31.6
  Bottom 0.2: D32.K 82.5,22.5 80.5,24.5 80.5,27 79.5,28 66.6,28 63,31.6 v61.3,31.6
LED_STAT25  (via drill 0.2)
  Top 0.2: U7.P$52 46.5,38.5 59.8,25.2 v60.9,25.2
  Bottom 0.2: D33.K 133,12.5 130,15.5 130,18.5 128,20.5 67.9,20.5 63.2,25.2 v60.9,25.2
LED_STAT26  (via drill 0.2)
  Top 0.2: U7.P$51 46.43,38 59.83,24.6 v61.5,24.6
  Bottom 0.2: D34.K 122.5,12.5 120.5,14.5 120.5,18 118.5,20 67.8,20 63.2,24.6 v61.5,24.6
LED_STAT27  (via drill 0.2)
  Top 0.2: v60.9,24 60.7,24.2 57.6,24.2 56.2,25.6 42.6,25.6 33.7,34.5 U7.P$48
  Bottom 0.2: D35.K 112,12.5 110,14.5 110,18 108.5,19.5 67.7,19.5 63.2,24 v60.9,24
LED_STAT28  (via drill 0.2)
  Top 0.2: U7.P$47 33.25,35.95 33.25,34.38 42.43,25.2 56,25.2 57.8,23.4 v61.5,23.4
  Bottom 0.2: D36.K 102,12.5 100,14.5 100,17.5 98.5,19 67.6,19 63.2,23.4 v61.5,23.4
LED_STAT29  (via drill 0.2)
  Top 0.2: U7.P$46 32.7,34.37 42.27,24.8 55.8,24.8 57.8,22.8 v60.9,22.8
  Bottom 0.2: D37.K 92,12.5 90,14.5 90,17 88.5,18.5 67.5,18.5 63.2,22.8 v60.9,22.8
LED_STAT30  (via drill 0.2)
  Top 0.2: U7.P$45 32.25,35.95 32.25,34.25 34.5,32 | 34.5,32 | v61.5,22.2 57.8,22.2 55.6,24.4 42.1,24.4 34.5,32
  Bottom 0.2: D38.K 82.5,12.5 80.5,14.5 80.5,17 79.5,18 67.4,18 63.2,22.2 v61.5,22.2
N$1
  Top 0.2: R26.P$2 68,50.5 70,48.5 126.5,48.5 133.04,55.04 D9.A
N$2
  Top 0.2: R1.P$2 U10.P$1
N$3
  Top 0.2: R2.P$2 5.66,34.54 U10.P$2
N$4
  Top 0.4: U4.6 108.4,70.1 109,70.7 C4.P$1
N$5
  Top 0.2: R27.P$2 70,51 72,49 117,49 123,55 124.96,55 D10.A
N$6
  Top 0.2: R32.P$2 68,40.5 70,38.5 126.5,38.5 133.04,45.04 D15.A
N$7
  Top 0.2: U4.1 107.8,72.9 108,72.9
  Top 0.4: D2.K 114,72.4 113.9,72.3 L2.P$1
  Top 1: L2.P$1 C4.P$2 109,72.3 108.4,72.9 107.8,72.9
N$8
  Top 0.2: R5.P$2 2.52,37.1 U10.P$3
N$9
  Top 0.4: R3.P$2 101.8,71.2 102,71 R4.P$1 103.9,70.3 104.1,70.1 U4.4
N$10
  Top 0.3: R10.P$2 82.8,115.1 83,115.3 R9.P$1 84.3,116.2 85.15,115.35 U8.P$2
N$11  (via drill 0.2)
  Top 0.2: D5.K 83.4,119.5 83.6,119.5
  Top 0.3: C2.P$2 R9.P$2 | D5.K R9.P$2 | U8.P$3 v84.2,114.7 | R9.P$2 v84.6,117.8
  Top 0.4: 87.5,116.28 U8.P$1
  Top 1: 87.5,116.28 87.5,119.5 83.4,119.5
  Bottom 0.3: v84.2,114.7 84.2,116.8 84.6,117.2 v84.6,117.8
N$12
  Top 0.2: D1.K R11.P$2
N$13
  Top 0.4: U6.6 86.4,70.1 87,70.7 C10.P$1
N$14
  Top 0.2: U6.1 85.7,72.9 86,72.9
  Top 0.4: D4.K 91.9,72.4 91.8,72.3 L4.P$1
  Top 1: L4.P$1 C10.P$2 87.2,72.3 86.6,72.9 85.7,72.9
N$15
  Top 0.4: U6.4 82.3,70.1 82.1,70.3 R8.P$1 80,71 79.8,71.2 R7.P$2
N$16
  Top 0.2: 82.8,108.33 C3.P$2 84.4,108 86,109.6 86,110.6 87.5,112.1 U8.P$6
N$17
  Top 0.2: D39.K R56.P$2
N$18
  Top 0.3: R13.P$2 R15.P$1 R12.P$1
N$19
  Top 0.3: U8.P$8 95.3,113.4 96.2,112.5 R14.P$2
N$20
  Top 0.3: U8.P$7 94.15,112.75 94.7,112.2 94.7,109.5 95.2,109 R15.P$2
N$21
  Top 0.2: 92.6,116.33 92.55,116.28 U8.P$12 | D3.K 100.6,120
  Top 1: 92.6,116.33 92.6,117.3 L1.P$2 100,118.3 100.6,118.9 100.6,120 C8.P$2
N$22  (via drill 0.2)
  Top 0.4: D6.K C8.P$1 104.3,121.5 103.9,121.9 97.5,121.9 v96.8,121.2 | U8.P$11 96.05,115.35 v96.8,116.1
  Bottom 0.4: v96.8,116.1 v96.8,121.2
N$23
  Top 0.4: U8.P$10 L1.P$1
  Top 1: L1.P$1 102.4,114.7 102.8,115.1 102.8,115.7 103.1,116 R16.P$1
N$24
  Top 0.3: R22.P$2 R14.P$1
N$25
  Top 0.4: D6.A D7.P$1
N$26  (via drill 3.2)
  other vias: 5,135
N$27  (via drill 0.2)
  Top 0.2: U9.P$5 v97,95.5 | U12.4 114.41,92.69 v114,93.1
  Bottom 0.2: v97,95.5 100,95.5 100.5,95 100.5,94 101,93.5 113.6,93.5 v114,93.1
N$28
  Top 0.2: U9.P$4 99,97 99.6,97.6 U13.1 98.3,98.4 98.2,98.5 R23.P$1
N$29  (via drill 3.2)
  other vias: 135,135
N$30  (via drill 3.2)
  other vias: 135,5
N$31  (via drill 3.2)
  other vias: 5,5
N$32
  Top 0.2: D11.A 114.04,55.04 108.5,49.5 73.5,49.5 72,51 R28.P$2
N$33
  Top 0.2: R29.P$2 74,51 75,50 98.5,50 103.5,55 104.96,55 D12.A
N$34
  Top 0.2: R30.P$2 76,51 76.5,50.5 88.5,50.5 93.04,55.04 D13.A
N$35
  Top 0.2: R31.P$2 81.7,52.2 84.54,55.04 D14.A
N$36
  Top 0.4: R57.P$2 D40.K
N$37
  Top 0.2: R33.P$2 70,41 72,39 117,39 123.04,45.04 D16.A
N$38
  Top 0.2: R34.P$2 72,41 73.5,39.5 108.5,39.5 114.04,45.04 D17.A
N$39
  Top 0.2: R35.P$2 74,41 75,40 98.5,40 103.54,45.04 D18.A
N$40
  Top 0.2: R36.P$2 76,41 76.5,40.5 88.5,40.5 93.04,45.04 D19.A
N$41
  Top 0.2: R37.P$2 81.7,42.2 84.54,45.04 D20.A
N$42
  Top 0.2: R38.P$2 68,30.5 70,28.5 126.5,28.5 133.04,35.04 D21.A
N$43
  Top 0.2: R39.P$2 70,31 72,29 117,29 123.04,35.04 D22.A
N$44
  Top 0.2: R40.P$2 72,31 73.5,29.5 108.5,29.5 114.04,35.04 D23.A
N$45
  Top 0.2: R41.P$2 74,31 75,30 98.5,30 103.54,35.04 D24.A
N$46
  Top 0.2: R42.P$2 76,31 76.5,30.5 88.5,30.5 93.04,35.04 D25.A
N$47
  Top 0.2: R43.P$2 81.7,32.2 84.54,35.04 D26.A
N$48
  Top 0.2: R44.P$2 68,20.5 70,18.5 126.5,18.5 133.04,25.04 D27.A
N$49
  Top 0.2: R45.P$2 70,21 72,19 117,19 123.04,25.04 D28.A
N$50
  Top 0.2: R46.P$2 72,21 73.5,19.5 108.5,19.5 114.04,25.04 D29.A
N$51
  Top 0.2: R47.P$2 74,21 75,20 98.5,20 103.54,25.04 D30.A
N$52
  Top 0.2: R48.P$2 76,21 76.5,20.5 88.5,20.5 93.04,25.04 D31.A
N$53
  Top 0.2: R49.P$2 81.7,22.2 84.54,25.04 D32.A
N$54
  Top 0.2: R50.P$2 68,10.5 70,8.5 126.5,8.5 133.04,15.04 D33.A
N$55
  Top 0.2: R51.P$2 70,11 72,9 117,9 123.04,15.04 D34.A
N$56
  Top 0.2: R52.P$2 72,11 73.5,9.5 108.5,9.5 114.04,15.04 D35.A
N$57
  Top 0.2: R53.P$2 74,11 75,10 98.5,10 103.54,15.04 D36.A
N$58
  Top 0.2: R54.P$2 76,11 76.5,10.5 88.5,10.5 93.04,15.04 D37.A
N$59
  Top 0.2: R55.P$2 81.7,12.2 84.54,15.04 D38.A
N$60
  Top 0.2: D40.A 102,98.5 101.9,98.4 U13.2
SWCLK  (via drill 0.2)
  Top 0.2: J1.P$3 3.53,17.2 9.2,17.2 10.9,18.9 17.2,25.2 v19.4,25.2 | U7.P$76 34.7,50.8 34.4,50.5 29.6,50.5 25.8,46.7 v25.8,44.5
  Bottom 0.2: v25.8,44.5 25.8,42.6 25.6,42.4 23.53,42.4 22.7,41.57 22.7,32.3 19.4,29 19.4,28.45 arc-90 19.05,28.09 arc90 18.7,27.75 18.7,27.6 arc90 19.05,27.25 arc-90 19.4,26.9 v19.4,25.2
SWDIO  (via drill 0.2)
  Top 0.2: J1.P$4 3.51,16.7 9.4,16.7 17.2,24.5 v20,24.5 | U7.P$72 36.65,48.55 33.5,48.55 32.95,49.1 30.3,49.1 27.4,46.2 v27.4,42.7
  Bottom 0.2: v27.4,42.7 26.7,42 23.7,42 23.2,41.5 23.2,32.1 20,28.9 v20,24.5
USB_RX_UART_TX  (via drill 0.2)
  Top 0.2: U5.P$3 72.2,5.12 72.2,6.3 71.4,7.1 68.43,7.1 60.13,15.4 48.7,15.4 v46.8,17.3 | U7.P$63 43.7,44 44.2,44.5 v45.5,44.5
  Bottom 0.2: v45.5,44.5 46.2,44.5 46.8,43.9 v46.8,17.3
USB_TX_UART_RX  (via drill 0.2)
  Top 0.2: U5.P$4 73.62,4.1 72.6,5.12 72.6,6.5 71.6,7.5 68.6,7.5 60.3,15.8 48.9,15.8 47.5,17.2 v47.5,17.8 | U7.P$64 43.6,44.5 44.2,45.1 v46.1,45.1
  Bottom 0.2: v46.1,45.1 46.5,45.1 47.2,44.4 47.2,18.7 47.5,18.4 v47.5,17.8
V_SMPS_12V  (via drill 1.5)
  Top 0.5: U9.P$6 93.45,94.55
  other vias: 78,103.5 80.5,103.5 83,103.5 85.5,103.5 88,103.5 90.5,103.5 93,103.5 78,101 80.5,101 83,101 85.5,101 88,101 90.5,101 93,101 78,98.5 80.5,98.5 83,98.5 85.5,98.5 88,98.5 90.5,98.5 93,98.5
  pour Bottom (rank 3, no thermals): 95,93 62,93 62,131 95,131
  pour Top (isolate 0.3, rank 3, no thermals): 94.5,93 74,93 74,105.5 94.5,105.5
VBAT_12V  (via drill 3)
  Top 0.4: U8.P$9 92.58,114.03 95.45,114.03 96.38,113.1 107.6,113.1 | R12.P$2 C7.P$2 102.8,107 104.7,105.1 107.6,105.1
  Top 0.5: U9.P$1 108.05,94.55 109.31,95.81 U12.8
  other vias: 119.5,128
  pour Top (isolate 0.3, rank 4, no thermals): 111,132 127,132 127,116 118,116 118,95 107,95 107,132
VCAP5
  Top 0.2: U7.P$73 42.4,49 42.9,49.5 C32.P$1
VCAP6
  Top 0.2: U7.P$49 34.2,34.6 34.8,34 C31.P$1
VCC_3.3V  (via drill 0.2, 0.3, 3)
  Top 0.2: C33.P$2 22.9,30.9 23.7,31.7 U7.P$28 | C37.P$2 42.1,36 41.6,35.5 41.6,34.9 41.1,34.4 35,34.4 34.7,34.7 U7.P$50 | C40.P$2 16,34.2 16.8,35 16.8,38.2 18.6,40 U7.P$21 | C39.P$2 16.1,32.2 17.2,33.3 17.2,37.9 18.8,39.5 U7.P$22 | U7.P$75 39.1,50 39.5,50.4 39.5,52.5 40,53 C38.P$2 | C35.P$2 14.8,37.7 16,38.9 16,39.8 17.2,41 U7.P$19 | R25.P$2 v21.5,63 | R24.P$2 v23.5,63 | R18.P$2 v25.5,63 | C34.P$2 v17.1,52 U7.P$100 | C41.P$2 v17.1,49.4 17.2,49.4 19.1,47.5 U7.P$6 | C36.P$2 v17.1,46.8 18.9,45 U7.P$11 | R21.P$2 v9.3,41.7 | R20.P$2 v32.5,27.7 | 67.93,23.8 R44.P$1
  Top 0.4: v8.2,60.8 v8.2,60.81 U3.P5 | R8.P$2 80.4,69.1 | 90.5,64.6 90.6,64.5
  Top 0.5: R55.P$1 R54.P$1 R53.P$1 R52.P$1 R51.P$1 R50.P$1 63.1,13.8 56.2,20.7 v55.8,20.7 v54.8,20.7 v53.8,20.7 | R49.P$1 R48.P$1 R47.P$1 R46.P$1 R45.P$1 67.93,23.8 | R43.P$1 R42.P$1 R41.P$1 R40.P$1 R39.P$1 R38.P$1 65.4,33.8 59.6,39.6 v55.8,39.6 v54.9,39.6 v54,39.6 | R37.P$1 R36.P$1 R35.P$1 R34.P$1 R33.P$1 R32.P$1 64.7,43.8 v55.2,53.3 v54.5,54 v53.8,54.7 | R31.P$1 R30.P$1 R29.P$1 R28.P$1 R27.P$1 R26.P$1 65,53.8 63.7,55.1 60,55.1 v55.7,59.4 v54.4,59.4 v53.1,59.4 | R44.P$1 65.6,23.8 60.8,28.6 57.6,28.6 v55.4,30.8 v54.7,31.5 v54,32.2
  Top 1: L4.P$2 90.5,64.6
  Bottom 0.5: U2.P$1 54,20.5 v53.8,20.7 | U1.P$1 11.5,21.2 | 11.5,21.2 11.7,21.4 | J1.P$1 9.39,23.31 11.5,21.2
  other vias: 125,67 42.9,53 42.9,36 22.9,29.3 14,32.2 14,37.7 14,34.2 12.2,63.5 49.1,20.9 45.9,20.9 45.9,23.6 49.1,23.6 28.8,67.2 30,67.2 28.8,66 28.8,64.2 30,66 30,64.2 31.2,64.2 32.4,64.2 33.6,64.2 34.8,64.2 36,64.2 37.2,64.2 36,67.2 37.2,67.2 36,66 37.2,66 33.6,67.2 34.8,67.2 33.6,66 34.8,66 31.2,67.2 32.4,67.2 31.2,66 32.4,66
  pour Bottom: 8,67.5 56,67.5 56,20.5 8,20.5
  pour Top (isolate 0.2, rank 3, no thermals): 121,71.5 129,71.5 129,60.5 62.5,60.5 62.5,64 28.2,63.9 28.2,69 81.9,69 81.9,65.1 121,65
VCC_5V  (via drill 0.2, 0.3, 3)
  Top 0.4: U3.P3 18.04,59.54 19,60.5 19,64.5 v23,68.5 | L2.P$2 112.7,70.5
  Top 1: L2.P$2 112.5,67.5
  Bottom 0.4: v23,68.5 97,68.5 98,67.5 v98,66
  other vias: 125,76.5
  pour Top (rank 4, no thermals): 103.5,69.5 96.5,69.5 96.5,65.5 121,65.5 121,71.5 129,71.5 129,80 118.5,80 118.5,68 103.5,68

### Text on the board
tPlace: + | - | - | BAT | - | + | + | SMPS | GND | 12V | 5V | 3.3V | CANL | CANH
tDocu: 24V to 12V SMPS | Lead Acid BAT charger | Powerpath / controller | 12V to 5V / Regulator | 12V to 3.3V / Regulator